# EAGLE schematic Motherboard (EAGLE 6.2)

## Sheet 1 of 9: Main Processor
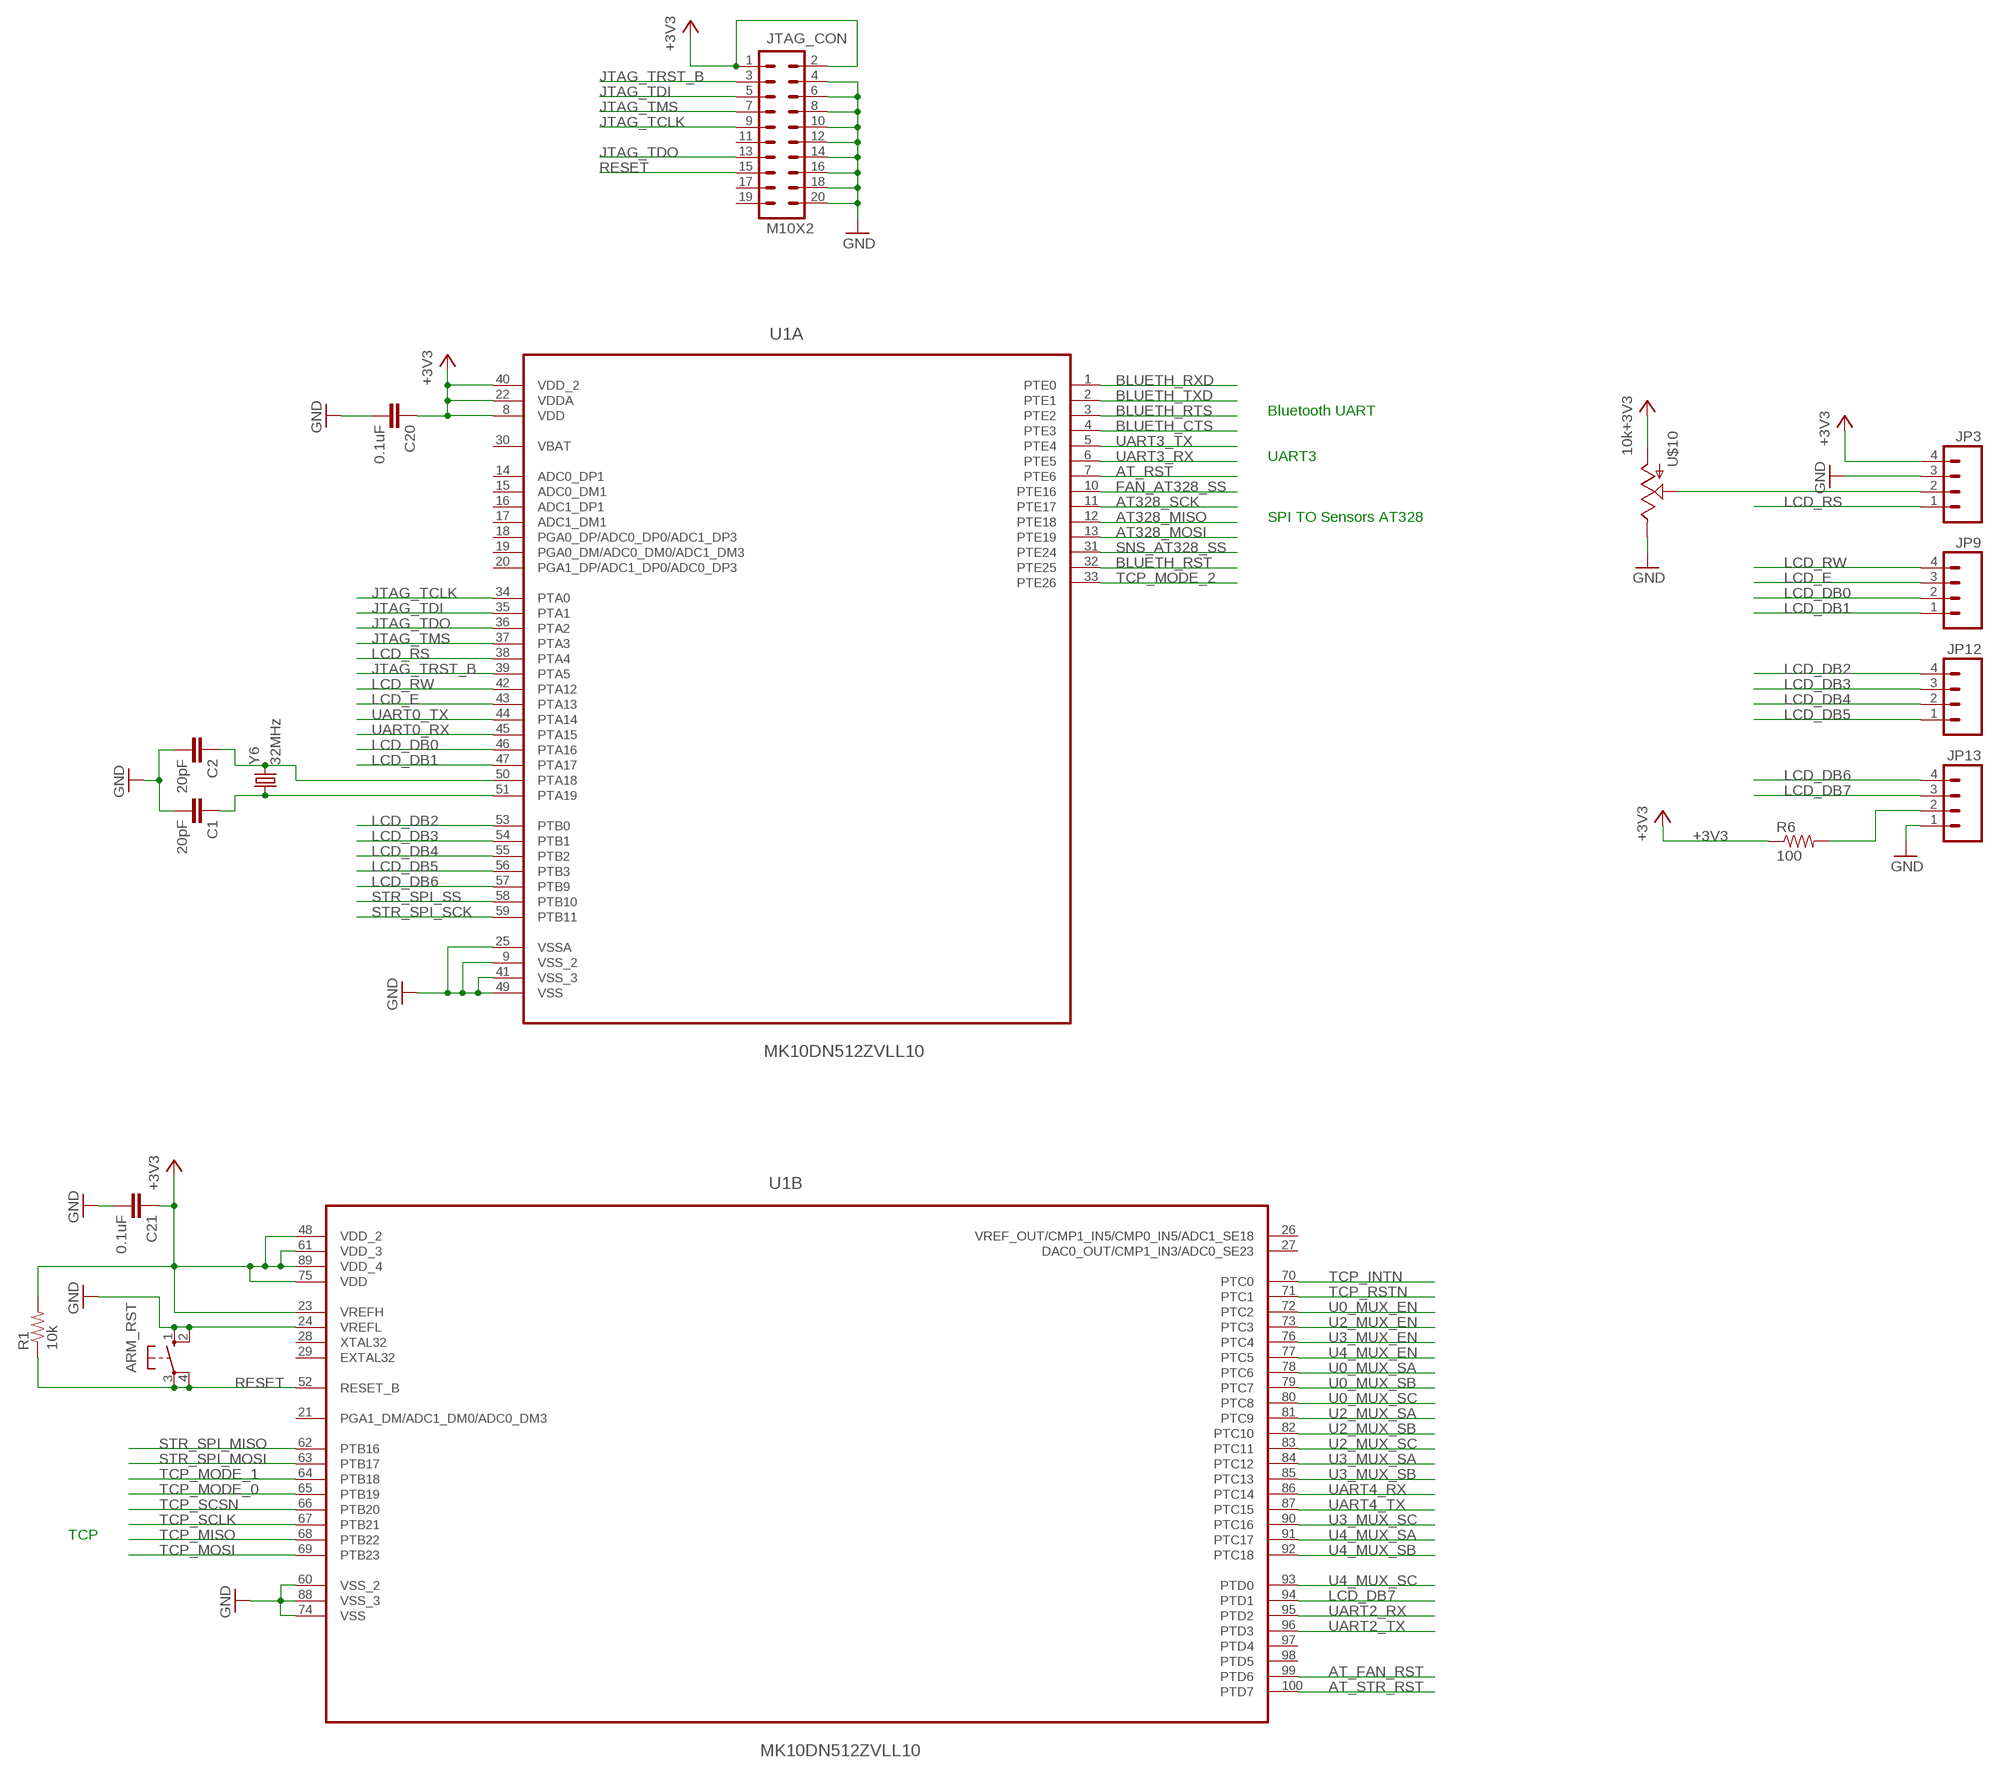
[diagram p0: schematic, sheet 1]

### Parts
ARM_RST  10-XX  [B3F-10XX]
C1  20pF  CAP1206  [1206]
C2  20pF  CAP1206  [1206]
C20  0.1uF  CAP1206  [1206]
C21  0.1uF  CAP1206  [1206]
JP3  M04POLAR  [MOLEX-1X4]
JP9  M04POLAR  [MOLEX-1X4]
JP12  M04POLAR  [MOLEX-1X4]
JP13  M04POLAR  [MOLEX-1X4]
JTAG_CON  M10X2  [2X10]
R1  10k  RESISTOR1206  [1206]
R6  100  RESISTOR1206  [1206]
U1  MK10DN512ZVLL10  [QFP50P1600X1600X170-100N]
U$10  10k  POT100K_3362U  [3362U]
Y6  32MHz  CRYSTAL5X3  [CRYSTAL-SMD-5X3]

### Nets
+3V3: C20.1 C21.1 JP3.4 JTAG_CON.1 JTAG_CON.2 R1.2 R6.1 U1.8(A:VDD) U1.22(A:VDDA) U1.23(B:VREFH) U1.40(A:VDD_2) U1.48(B:VDD_2) U1.61(B:VDD_3) U1.75(B:VDD) U1.89(B:VDD_4) U$10.P$3(A) ; also sheet 2,3,4,5,6,7,8,9
AT328_MISO: U1.12(A:PTE18) ; also sheet 6,8
AT328_MOSI: U1.13(A:PTE19) ; also sheet 6,8
AT328_SCK: U1.11(A:PTE17) ; also sheet 6,8
AT_FAN_RST: U1.99(B:PTD6) ; also sheet 8
AT_RST: U1.7(A:PTE6) ; also sheet 6
AT_STR_RST: U1.100(B:PTD7) ; also sheet 7
BLUETH_CTS: U1.4(A:PTE3) ; also sheet 2
BLUETH_RST: U1.32(A:PTE25) ; also sheet 2
BLUETH_RTS: U1.3(A:PTE2) ; also sheet 2
BLUETH_RXD: U1.1(A:PTE0) ; also sheet 2
BLUETH_TXD: U1.2(A:PTE1) ; also sheet 2
CLKI: C2.1 U1.50(A:PTA18) Y6.3
CLKO: C1.1 U1.51(A:PTA19) Y6.1
FAN_AT328_SS: U1.10(A:PTE16) ; also sheet 8
GND: ARM_RST.1(S) ARM_RST.2(S1) C1.2 C2.2 C20.2 C21.2 JP3.3 JP13.1 JTAG_CON.4 JTAG_CON.6 JTAG_CON.8 JTAG_CON.10 JTAG_CON.12 JTAG_CON.14 JTAG_CON.16 JTAG_CON.18 JTAG_CON.20 U1.9(A:VSS_2) U1.24(B:VREFL) U1.25(A:VSSA) U1.41(A:VSS_3) U1.49(A:VSS) U1.60(B:VSS_2) U1.74(B:VSS) U1.88(B:VSS_3) U$10.P$1(E) ; also sheet 2,3,4,5,6,7,8,9
JTAG_TCLK: JTAG_CON.9 U1.34(A:PTA0)
JTAG_TDI: JTAG_CON.5 U1.35(A:PTA1)
JTAG_TDO: JTAG_CON.13 U1.36(A:PTA2)
JTAG_TMS: JTAG_CON.7 U1.37(A:PTA3)
JTAG_TRST_B: JTAG_CON.3 U1.39(A:PTA5)
LCD_DB0: JP9.2 U1.46(A:PTA16)
LCD_DB1: JP9.1 U1.47(A:PTA17)
LCD_DB2: JP12.4 U1.53(A:PTB0)
LCD_DB3: JP12.3 U1.54(A:PTB1)
LCD_DB4: JP12.2 U1.55(A:PTB2)
LCD_DB5: JP12.1 U1.56(A:PTB3)
LCD_DB6: JP13.4 U1.57(A:PTB9)
LCD_DB7: JP13.3 U1.94(B:PTD1)
LCD_E: JP9.3 U1.43(A:PTA13)
LCD_RS: JP3.1 U1.38(A:PTA4)
LCD_RW: JP9.4 U1.42(A:PTA12)
N$46: JP13.2 R6.2
N$60: JP3.2 U$10.P$2(S)
RESET: ARM_RST.3(P) ARM_RST.4(P1) JTAG_CON.15 R1.1 U1.52(B:RESET_B)
SNS_AT328_SS: U1.31(A:PTE24) ; also sheet 6
STR_SPI_MISO: U1.62(B:PTB16) ; also sheet 7
STR_SPI_MOSI: U1.63(B:PTB17) ; also sheet 7
STR_SPI_SCK: U1.59(A:PTB11) ; also sheet 7
STR_SPI_SS: U1.58(A:PTB10) ; also sheet 7
TCP_INTN: U1.70(B:PTC0) ; also sheet 2
TCP_MISO: U1.68(B:PTB22) ; also sheet 2
TCP_MODE_0: U1.65(B:PTB19) ; also sheet 2
TCP_MODE_1: U1.64(B:PTB18) ; also sheet 2
TCP_MODE_2: U1.33(A:PTE26) ; also sheet 2
TCP_MOSI: U1.69(B:PTB23) ; also sheet 2
TCP_RSTN: U1.71(B:PTC1) ; also sheet 2
TCP_SCLK: U1.67(B:PTB21) ; also sheet 2
TCP_SCSN: U1.66(B:PTB20) ; also sheet 2
U0_MUX_EN: U1.72(B:PTC2) ; also sheet 3
U0_MUX_SA: U1.78(B:PTC6) ; also sheet 3
U0_MUX_SB: U1.79(B:PTC7) ; also sheet 3
U0_MUX_SC: U1.80(B:PTC8) ; also sheet 3
U2_MUX_EN: U1.73(B:PTC3) ; also sheet 3
U2_MUX_SA: U1.81(B:PTC9) ; also sheet 3
U2_MUX_SB: U1.82(B:PTC10) ; also sheet 3
U2_MUX_SC: U1.83(B:PTC11) ; also sheet 3
U3_MUX_EN: U1.76(B:PTC4) ; also sheet 3
U3_MUX_SA: U1.84(B:PTC12) ; also sheet 3
U3_MUX_SB: U1.85(B:PTC13) ; also sheet 3
U3_MUX_SC: U1.90(B:PTC16) ; also sheet 3
U4_MUX_EN: U1.77(B:PTC5) ; also sheet 3
U4_MUX_SA: U1.91(B:PTC17) ; also sheet 3
U4_MUX_SB: U1.92(B:PTC18) ; also sheet 3
U4_MUX_SC: U1.93(B:PTD0) ; also sheet 3
UART0_RX: U1.45(A:PTA15) ; also sheet 3
UART0_TX: U1.44(A:PTA14) ; also sheet 3
UART2_RX: U1.95(B:PTD2) ; also sheet 3
UART2_TX: U1.96(B:PTD3) ; also sheet 3
UART3_RX: U1.6(A:PTE5) ; also sheet 3
UART3_TX: U1.5(A:PTE4) ; also sheet 3
UART4_RX: U1.86(B:PTC14) ; also sheet 3
UART4_TX: U1.87(B:PTC15) ; also sheet 3
Unconnected: JTAG_CON.11 JTAG_CON.17 JTAG_CON.19 U1.14(A:ADC0_DP1) U1.15(A:ADC0_DM1) U1.16(A:ADC1_DP1) U1.17(A:ADC1_DM1) U1.18(A:PGA0_DP/ADC0_DP0/ADC1_DP3) U1.19(A:PGA0_DM/ADC0_DM0/ADC1_DM3) U1.20(A:PGA1_DP/ADC1_DP0/ADC0_DP3) U1.21(B:PGA1_DM/ADC1_DM0/ADC0_DM3) U1.26(B:VREF_OUT/CMP1_IN5/CMP0_IN5/ADC1_SE18) U1.27(B:DAC0_OUT/CMP1_IN3/ADC0_SE23) U1.28(B:XTAL32) U1.29(B:EXTAL32) U1.97(B:PTD4) U1.98(B:PTD5)

### Notes on the sheet
- Bluetooth UART
- UART3
- SPI TO Sensors AT328
- TCP

## Sheet 2 of 9: I/O
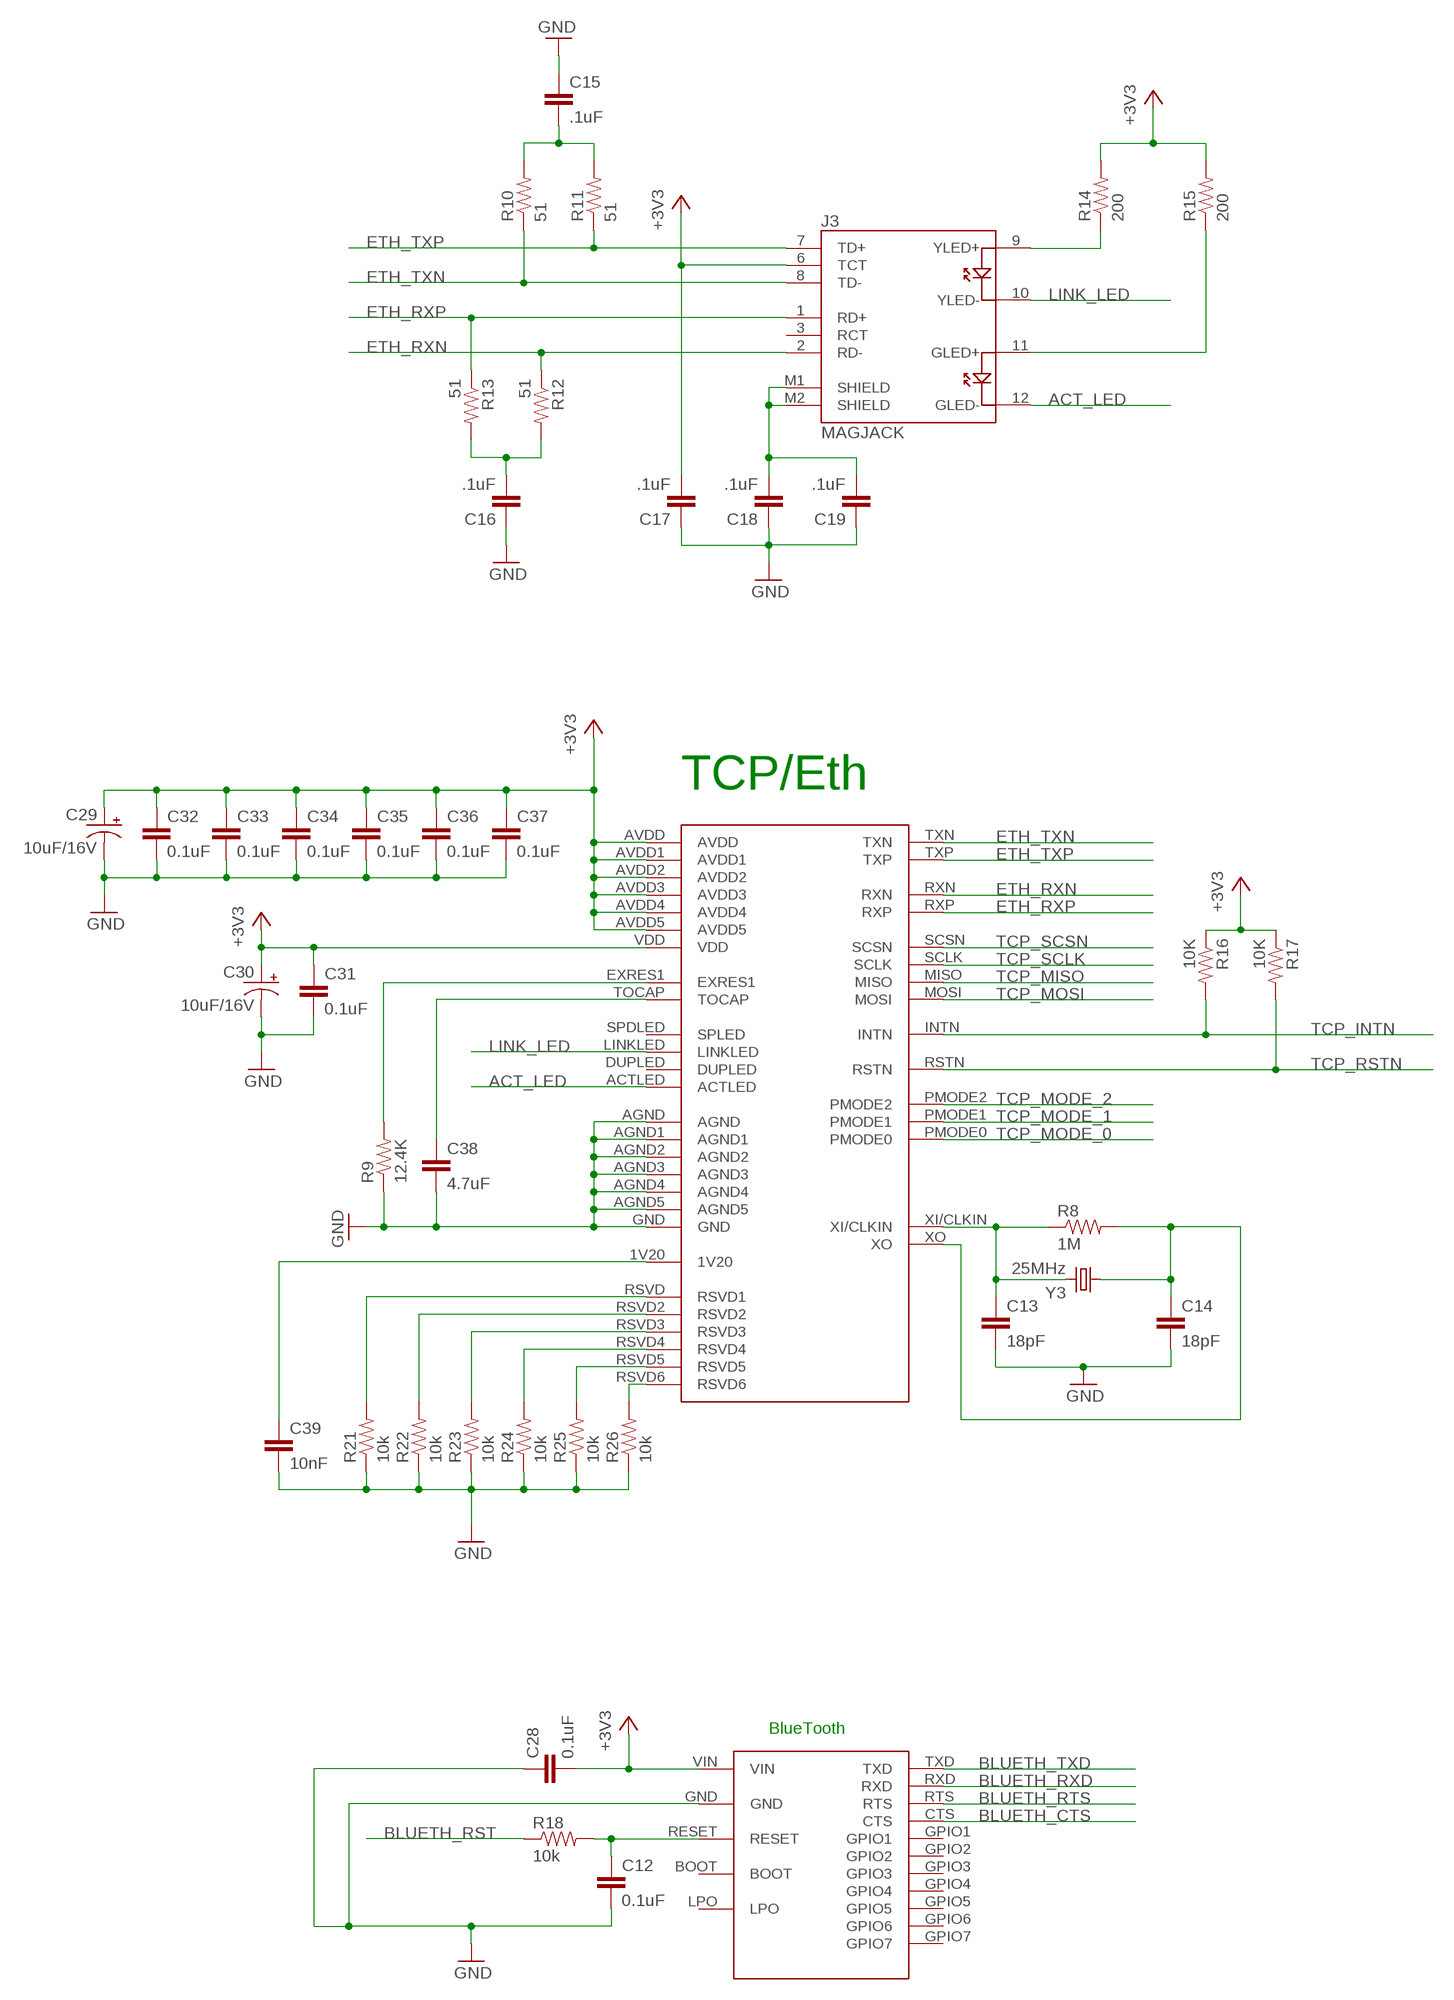
[diagram p1: schematic, sheet 2]

### Parts
BLUETOOTH  SPBT2632C2A  [SPBT2632C2A]
C12  0.1uF  CAP1206  [1206]
C13  18pF  CAP1206  [1206]
C14  18pF  CAP1206  [1206]
C15  .1uF  CAP1206  [1206]
C16  .1uF  CAP1206  [1206]
C17  .1uF  CAP1206  [1206]
C18  .1uF  CAP1206  [1206]
C19  .1uF  CAP1206  [1206]
C28  0.1uF  CAP1206  [1206]
C29  10uF/16V  CAP_POL1206  [EIA3216]
C30  10uF/16V  CAP_POL1206  [EIA3216]
C31  0.1uF  CAP1206  [1206]
C32  0.1uF  CAP1206  [1206]
C33  0.1uF  CAP1206  [1206]
C34  0.1uF  CAP1206  [1206]
C35  0.1uF  CAP1206  [1206]
C36  0.1uF  CAP1206  [1206]
C37  0.1uF  CAP1206  [1206]
C38  4.7uF  CAP1206  [1206]
C39  10nF  CAP1206  [1206]
J3  MAGJACK  [MAGJACK]
R8  1M  RESISTOR1206  [1206]
R9  12.4K  RESISTOR1206  [1206]
R10  51  RESISTOR1206  [1206]
R11  51  RESISTOR1206  [1206]
R12  51  RESISTOR1206  [1206]
R13  51  RESISTOR1206  [1206]
R14  200  RESISTOR1206  [1206]
R15  200  RESISTOR1206  [1206]
R16  10K  RESISTOR1206  [1206]
R17  10K  RESISTOR1206  [1206]
R18  10k  RESISTOR1206  [1206]
R21  10k  RESISTOR1206  [1206]
R22  10k  RESISTOR1206  [1206]
R23  10k  RESISTOR1206  [1206]
R24  10k  RESISTOR1206  [1206]
R25  10k  RESISTOR1206  [1206]
R26  10k  RESISTOR1206  [1206]
U$11  W5500  [W5500]
Y3  25MHz  CRYSTALHC49US  [HC49US]

### Nets
+3V3: BLUETOOTH.VIN C17.2 C28.2 C29.A(+) C30.A(+) C31.1 C32.1 C33.1 C34.1 C35.1 C36.1 C37.1 J3.6(TCT) R14.2 R15.2 R16.1 R17.1 U$11.AVDD U$11.AVDD1 U$11.AVDD2 U$11.AVDD3 U$11.AVDD4 U$11.AVDD5 U$11.VDD ; also sheet 1,3,4,5,6,7,8,9
ACT_LED: J3.12(GLED-) U$11.ACTLED
BLUETH_CTS: BLUETOOTH.CTS ; also sheet 1
BLUETH_RST: R18.1 ; also sheet 1
BLUETH_RTS: BLUETOOTH.RTS ; also sheet 1
BLUETH_RXD: BLUETOOTH.RXD ; also sheet 1
BLUETH_TXD: BLUETOOTH.TXD ; also sheet 1
ETH_RXN: J3.2(RD-) R12.1 U$11.RXN
ETH_RXP: J3.1(RD+) R13.1 U$11.RXP
ETH_TXN: J3.8(TD-) R10.1 U$11.TXN
ETH_TXP: J3.7(TD+) R11.1 U$11.TXP
GND: BLUETOOTH.GND C12.2 C13.2 C14.2 C15.1 C16.1 C17.1 C18.1 C19.1 C28.1 C29.C(-) C30.C(-) C31.2 C32.2 C33.2 C34.2 C35.2 C36.2 C37.2 C38.2 C39.2 R9.1 R21.1 R22.1 R23.1 R24.1 R25.1 R26.1 U$11.AGND U$11.AGND1 U$11.AGND2 U$11.AGND3 U$11.AGND4 U$11.AGND5 U$11.GND ; also sheet 1,3,4,5,6,7,8,9
LINK_LED: J3.10(YLED-) U$11.LINKLED
N$23: C13.1 R8.1 U$11.XI/CLKIN Y3.2
N$24: R9.2 U$11.EXRES1
N$25: C14.1 R8.2 U$11.XO Y3.1
N$26: C15.2 R10.2 R11.2
N$27: C16.2 R12.2 R13.2
N$30: J3.9(YLED+) R14.1
N$31: C18.2 C19.2 J3.M1(SHIELD) J3.M2(SHIELD)
N$32: J3.11(GLED+) R15.1
N$50: C38.1 U$11.TOCAP
N$51: R26.2 U$11.RSVD6
N$52: R25.2 U$11.RSVD5
N$53: R24.2 U$11.RSVD4
N$54: R23.2 U$11.RSVD3
N$55: R22.2 U$11.RSVD2
N$56: R21.2 U$11.RSVD(RSVD1)
N$57: C39.1 U$11.1V20
N$58: BLUETOOTH.RESET C12.1 R18.2
TCP_INTN: R16.2 U$11.INTN ; also sheet 1
TCP_MISO: U$11.MISO ; also sheet 1
TCP_MODE_0: U$11.PMODE0 ; also sheet 1
TCP_MODE_1: U$11.PMODE1 ; also sheet 1
TCP_MODE_2: U$11.PMODE2 ; also sheet 1
TCP_MOSI: U$11.MOSI ; also sheet 1
TCP_RSTN: R17.2 U$11.RSTN ; also sheet 1
TCP_SCLK: U$11.SCLK ; also sheet 1
TCP_SCSN: U$11.SCSN ; also sheet 1
Unconnected: BLUETOOTH.BOOT BLUETOOTH.GPIO1 BLUETOOTH.GPIO2 BLUETOOTH.GPIO3 BLUETOOTH.GPIO4 BLUETOOTH.GPIO5 BLUETOOTH.GPIO6 BLUETOOTH.GPIO7 BLUETOOTH.LPO J3.3(RCT) U$11.DUPLED U$11.SPDLED(SPLED)

### Notes on the sheet
- TCP/Eth
- BlueTooth

## Sheet 3 of 9: Muxes
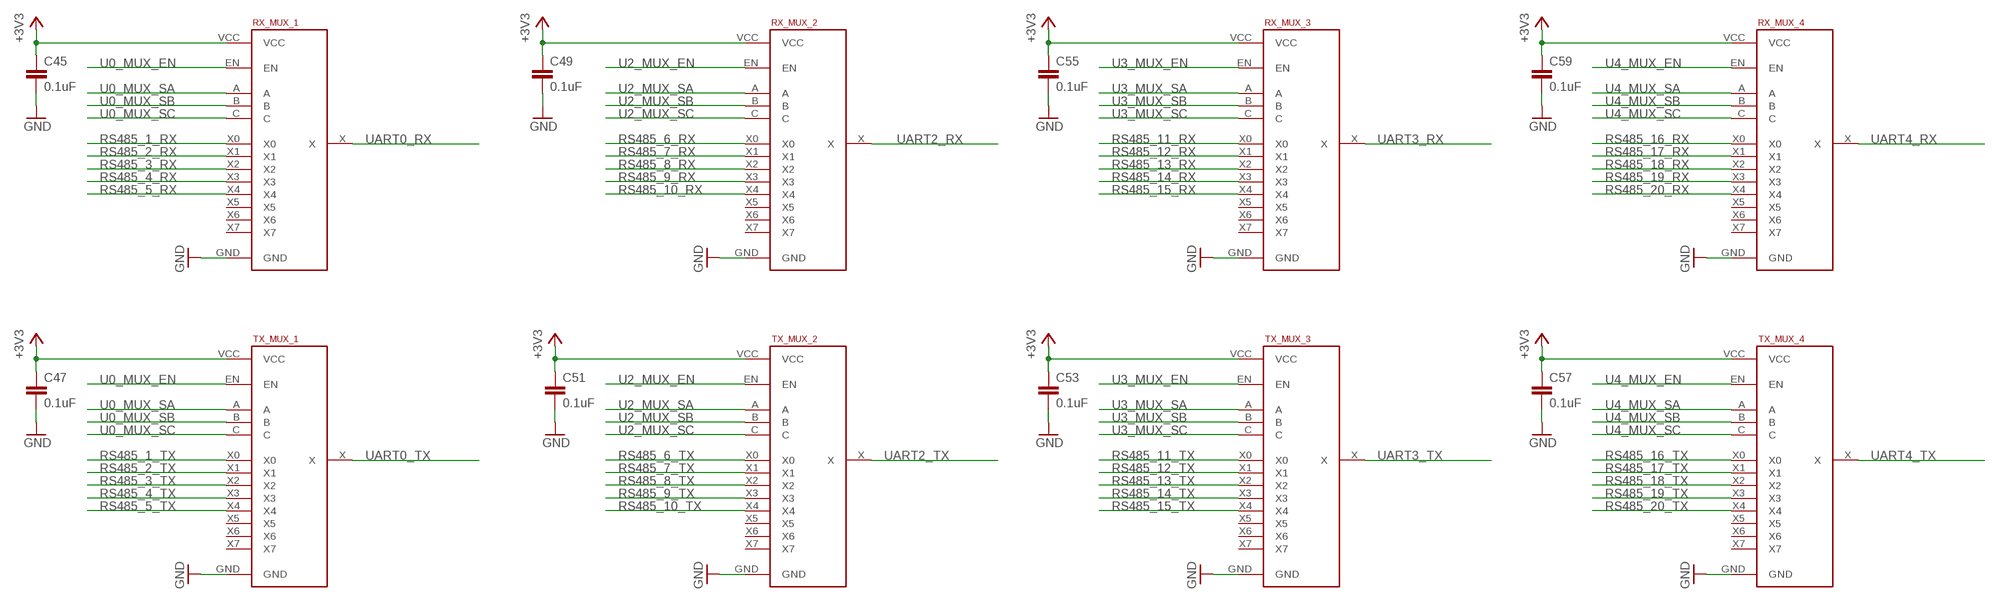
[diagram p2: schematic, sheet 3]

### Parts
C45  0.1uF  CAP1206  [1206]
C47  0.1uF  CAP1206  [1206]
C49  0.1uF  CAP1206  [1206]
C51  0.1uF  CAP1206  [1206]
C53  0.1uF  CAP1206  [1206]
C55  0.1uF  CAP1206  [1206]
C57  0.1uF  CAP1206  [1206]
C59  0.1uF  CAP1206  [1206]
RX_MUX_1  8:1 Mux  MC74LVXT8051DG  [SOIC16N]
RX_MUX_2  8:1 Mux  MC74LVXT8051DG  [SOIC16N]
RX_MUX_3  8:1 Mux  MC74LVXT8051DG  [SOIC16N]
RX_MUX_4  8:1 Mux  MC74LVXT8051DG  [SOIC16N]
TX_MUX_1  8:1 Mux  MC74LVXT8051DG  [SOIC16N]
TX_MUX_2  8:1 Mux  MC74LVXT8051DG  [SOIC16N]
TX_MUX_3  8:1 Mux  MC74LVXT8051DG  [SOIC16N]
TX_MUX_4  8:1 Mux  MC74LVXT8051DG  [SOIC16N]

### Nets
+3V3: C45.1 C47.1 C49.1 C51.1 C53.1 C55.1 C57.1 C59.1 RX_MUX_1.VCC RX_MUX_2.VCC RX_MUX_3.VCC RX_MUX_4.VCC TX_MUX_1.VCC TX_MUX_2.VCC TX_MUX_3.VCC TX_MUX_4.VCC ; also sheet 1,2,4,5,6,7,8,9
GND: C45.2 C47.2 C49.2 C51.2 C53.2 C55.2 C57.2 C59.2 RX_MUX_1.GND RX_MUX_2.GND RX_MUX_3.GND RX_MUX_4.GND TX_MUX_1.GND TX_MUX_2.GND TX_MUX_3.GND TX_MUX_4.GND ; also sheet 1,2,4,5,6,7,8,9
RS485_1_RX: RX_MUX_1.X0 ; also sheet 4
RS485_1_TX: TX_MUX_1.X0 ; also sheet 4
RS485_2_RX: RX_MUX_1.X1 ; also sheet 4
RS485_2_TX: TX_MUX_1.X1 ; also sheet 4
RS485_3_RX: RX_MUX_1.X2 ; also sheet 4
RS485_3_TX: TX_MUX_1.X2 ; also sheet 4
RS485_4_RX: RX_MUX_1.X3 ; also sheet 4
RS485_4_TX: TX_MUX_1.X3 ; also sheet 4
RS485_5_RX: RX_MUX_1.X4 ; also sheet 4
RS485_5_TX: TX_MUX_1.X4 ; also sheet 4
RS485_6_RX: RX_MUX_2.X0 ; also sheet 4
RS485_6_TX: TX_MUX_2.X0 ; also sheet 4
RS485_7_RX: RX_MUX_2.X1 ; also sheet 4
RS485_7_TX: TX_MUX_2.X1 ; also sheet 4
RS485_8_RX: RX_MUX_2.X2 ; also sheet 4
RS485_8_TX: TX_MUX_2.X2 ; also sheet 4
RS485_9_RX: RX_MUX_2.X3 ; also sheet 4
RS485_9_TX: TX_MUX_2.X3 ; also sheet 4
RS485_10_RX: RX_MUX_2.X4 ; also sheet 4
RS485_10_TX: TX_MUX_2.X4 ; also sheet 4
RS485_11_RX: RX_MUX_3.X0 ; also sheet 4
RS485_11_TX: TX_MUX_3.X0 ; also sheet 4
RS485_12_RX: RX_MUX_3.X1 ; also sheet 4
RS485_12_TX: TX_MUX_3.X1 ; also sheet 4
RS485_13_RX: RX_MUX_3.X2 ; also sheet 5
RS485_13_TX: TX_MUX_3.X2 ; also sheet 5
RS485_14_RX: RX_MUX_3.X3 ; also sheet 5
RS485_14_TX: TX_MUX_3.X3 ; also sheet 5
RS485_15_RX: RX_MUX_3.X4 ; also sheet 5
RS485_15_TX: TX_MUX_3.X4 ; also sheet 5
RS485_16_RX: RX_MUX_4.X0 ; also sheet 5
RS485_16_TX: TX_MUX_4.X0 ; also sheet 5
RS485_17_RX: RX_MUX_4.X1 ; also sheet 5
RS485_17_TX: TX_MUX_4.X1 ; also sheet 5
RS485_18_RX: RX_MUX_4.X2 ; also sheet 5
RS485_18_TX: TX_MUX_4.X2 ; also sheet 5
RS485_19_RX: RX_MUX_4.X3 ; also sheet 5
RS485_19_TX: TX_MUX_4.X3 ; also sheet 5
RS485_20_RX: RX_MUX_4.X4 ; also sheet 5
RS485_20_TX: TX_MUX_4.X4 ; also sheet 5
U0_MUX_EN: RX_MUX_1.EN TX_MUX_1.EN ; also sheet 1
U0_MUX_SA: RX_MUX_1.A TX_MUX_1.A ; also sheet 1
U0_MUX_SB: RX_MUX_1.B TX_MUX_1.B ; also sheet 1
U0_MUX_SC: RX_MUX_1.C TX_MUX_1.C ; also sheet 1
U2_MUX_EN: RX_MUX_2.EN TX_MUX_2.EN ; also sheet 1
U2_MUX_SA: RX_MUX_2.A TX_MUX_2.A ; also sheet 1
U2_MUX_SB: RX_MUX_2.B TX_MUX_2.B ; also sheet 1
U2_MUX_SC: RX_MUX_2.C TX_MUX_2.C ; also sheet 1
U3_MUX_EN: RX_MUX_3.EN TX_MUX_3.EN ; also sheet 1
U3_MUX_SA: RX_MUX_3.A TX_MUX_3.A ; also sheet 1
U3_MUX_SB: RX_MUX_3.B TX_MUX_3.B ; also sheet 1
U3_MUX_SC: RX_MUX_3.C TX_MUX_3.C ; also sheet 1
U4_MUX_EN: RX_MUX_4.EN TX_MUX_4.EN ; also sheet 1
U4_MUX_SA: RX_MUX_4.A TX_MUX_4.A ; also sheet 1
U4_MUX_SB: RX_MUX_4.B TX_MUX_4.B ; also sheet 1
U4_MUX_SC: RX_MUX_4.C TX_MUX_4.C ; also sheet 1
UART0_RX: RX_MUX_1.X ; also sheet 1
UART0_TX: TX_MUX_1.X ; also sheet 1
UART2_RX: RX_MUX_2.X ; also sheet 1
UART2_TX: TX_MUX_2.X ; also sheet 1
UART3_RX: RX_MUX_3.X ; also sheet 1
UART3_TX: TX_MUX_3.X ; also sheet 1
UART4_RX: RX_MUX_4.X ; also sheet 1
UART4_TX: TX_MUX_4.X ; also sheet 1
Unconnected: RX_MUX_1.X5 RX_MUX_1.X6 RX_MUX_1.X7 RX_MUX_2.X5 RX_MUX_2.X6 RX_MUX_2.X7 RX_MUX_3.X5 RX_MUX_3.X6 RX_MUX_3.X7 RX_MUX_4.X5 RX_MUX_4.X6 RX_MUX_4.X7 TX_MUX_1.X5 TX_MUX_1.X6 TX_MUX_1.X7 TX_MUX_2.X5 TX_MUX_2.X6 TX_MUX_2.X7 TX_MUX_3.X5 TX_MUX_3.X6 TX_MUX_3.X7 TX_MUX_4.X5 TX_MUX_4.X6 TX_MUX_4.X7

## Sheet 4 of 9: RS-485 External
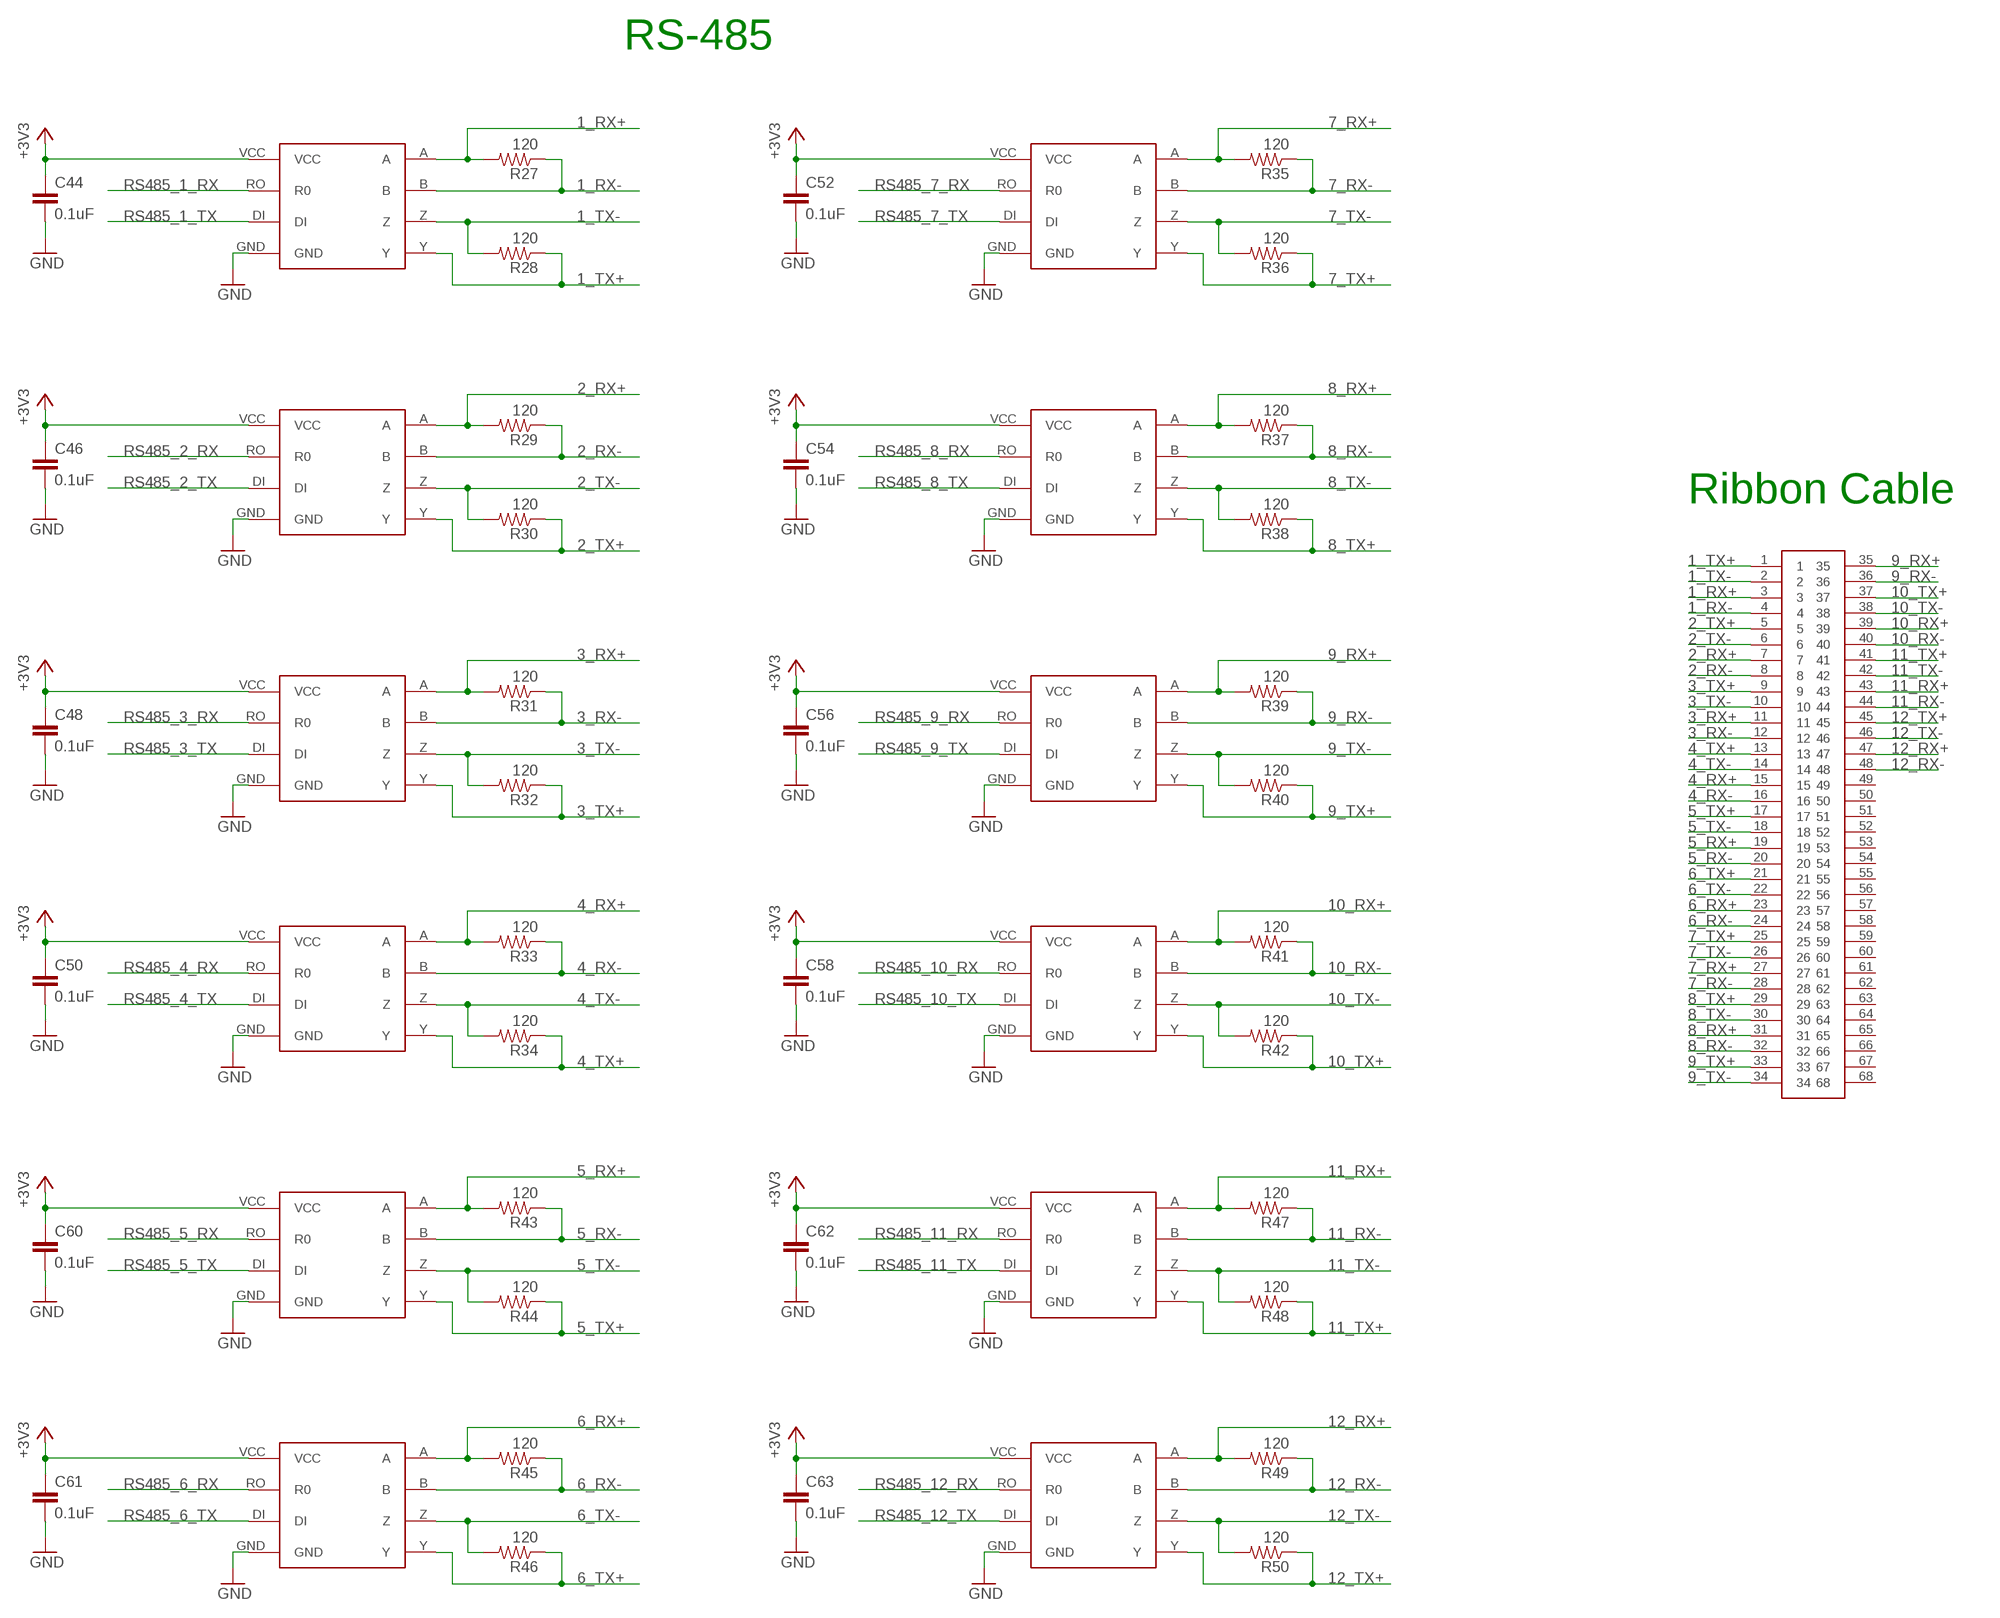
[diagram p3: schematic, sheet 4]

### Parts
C44  0.1uF  CAP1206  [1206]
C46  0.1uF  CAP1206  [1206]
C48  0.1uF  CAP1206  [1206]
C50  0.1uF  CAP1206  [1206]
C52  0.1uF  CAP1206  [1206]
C54  0.1uF  CAP1206  [1206]
C56  0.1uF  CAP1206  [1206]
C58  0.1uF  CAP1206  [1206]
C60  0.1uF  CAP1206  [1206]
C61  0.1uF  CAP1206  [1206]
C62  0.1uF  CAP1206  [1206]
C63  0.1uF  CAP1206  [1206]
R27  120  RESISTOR1206  [1206]
R28  120  RESISTOR1206  [1206]
R29  120  RESISTOR1206  [1206]
R30  120  RESISTOR1206  [1206]
R31  120  RESISTOR1206  [1206]
R32  120  RESISTOR1206  [1206]
R33  120  RESISTOR1206  [1206]
R34  120  RESISTOR1206  [1206]
R35  120  RESISTOR1206  [1206]
R36  120  RESISTOR1206  [1206]
R37  120  RESISTOR1206  [1206]
R38  120  RESISTOR1206  [1206]
R39  120  RESISTOR1206  [1206]
R40  120  RESISTOR1206  [1206]
R41  120  RESISTOR1206  [1206]
R42  120  RESISTOR1206  [1206]
R43  120  RESISTOR1206  [1206]
R44  120  RESISTOR1206  [1206]
R45  120  RESISTOR1206  [1206]
R46  120  RESISTOR1206  [1206]
R47  120  RESISTOR1206  [1206]
R48  120  RESISTOR1206  [1206]
R49  120  RESISTOR1206  [1206]
R50  120  RESISTOR1206  [1206]
RS_TRANS_1  MAX3077  [MAX3070E]
RS_TRANS_2  MAX3077  [MAX3070E]
RS_TRANS_3  MAX3077  [MAX3070E]
RS_TRANS_4  MAX3077  [MAX3070E]
RS_TRANS_5  MAX3077  [MAX3070E]
RS_TRANS_6  MAX3077  [MAX3070E]
RS_TRANS_7  MAX3077  [MAX3070E]
RS_TRANS_8  MAX3077  [MAX3070E]
RS_TRANS_9  MAX3077  [MAX3070E]
RS_TRANS_10  MAX3077  [MAX3070E]
RS_TRANS_11  MAX3077  [MAX3070E]
RS_TRANS_12  MAX3077  [MAX3070E]
U$36  TB60050685100  [60050685100]

### Nets
1_RX+: R27.2 RS_TRANS_1.A U$36.3
1_RX-: R27.1 RS_TRANS_1.B U$36.4
1_TX+: R28.1 RS_TRANS_1.Y U$36.1
1_TX-: R28.2 RS_TRANS_1.Z U$36.2
2_RX+: R29.2 RS_TRANS_2.A U$36.7
2_RX-: R29.1 RS_TRANS_2.B U$36.8
2_TX+: R30.1 RS_TRANS_2.Y U$36.5
2_TX-: R30.2 RS_TRANS_2.Z U$36.6
3_RX+: R31.2 RS_TRANS_3.A U$36.11
3_RX-: R31.1 RS_TRANS_3.B U$36.12
3_TX+: R32.1 RS_TRANS_3.Y U$36.9
3_TX-: R32.2 RS_TRANS_3.Z U$36.10
4_RX+: R33.2 RS_TRANS_4.A U$36.15
4_RX-: R33.1 RS_TRANS_4.B U$36.16
4_TX+: R34.1 RS_TRANS_4.Y U$36.13
4_TX-: R34.2 RS_TRANS_4.Z U$36.14
5_RX+: R43.2 RS_TRANS_9.A U$36.19
5_RX-: R43.1 RS_TRANS_9.B U$36.20
5_TX+: R44.1 RS_TRANS_9.Y U$36.17
5_TX-: R44.2 RS_TRANS_9.Z U$36.18
6_RX+: R45.2 RS_TRANS_10.A U$36.23
6_RX-: R45.1 RS_TRANS_10.B U$36.24
6_TX+: R46.1 RS_TRANS_10.Y U$36.21
6_TX-: R46.2 RS_TRANS_10.Z U$36.22
7_RX+: R35.2 RS_TRANS_5.A U$36.27
7_RX-: R35.1 RS_TRANS_5.B U$36.28
7_TX+: R36.1 RS_TRANS_5.Y U$36.25
7_TX-: R36.2 RS_TRANS_5.Z U$36.26
8_RX+: R37.2 RS_TRANS_6.A U$36.31
8_RX-: R37.1 RS_TRANS_6.B U$36.32
8_TX+: R38.1 RS_TRANS_6.Y U$36.29
8_TX-: R38.2 RS_TRANS_6.Z U$36.30
9_RX+: R39.2 RS_TRANS_7.A U$36.35
9_RX-: R39.1 RS_TRANS_7.B U$36.36
9_TX+: R40.1 RS_TRANS_7.Y U$36.33
9_TX-: R40.2 RS_TRANS_7.Z U$36.34
10_RX+: R41.2 RS_TRANS_8.A U$36.39
10_RX-: R41.1 RS_TRANS_8.B U$36.40
10_TX+: R42.1 RS_TRANS_8.Y U$36.37
10_TX-: R42.2 RS_TRANS_8.Z U$36.38
11_RX+: R47.2 RS_TRANS_11.A U$36.43
11_RX-: R47.1 RS_TRANS_11.B U$36.44
11_TX+: R48.1 RS_TRANS_11.Y U$36.41
11_TX-: R48.2 RS_TRANS_11.Z U$36.42
12_RX+: R49.2 RS_TRANS_12.A U$36.47
12_RX-: R49.1 RS_TRANS_12.B U$36.48
12_TX+: R50.1 RS_TRANS_12.Y U$36.45
12_TX-: R50.2 RS_TRANS_12.Z U$36.46
+3V3: C44.1 C46.1 C48.1 C50.1 C52.1 C54.1 C56.1 C58.1 C60.1 C61.1 C62.1 C63.1 RS_TRANS_1.VCC RS_TRANS_2.VCC RS_TRANS_3.VCC RS_TRANS_4.VCC RS_TRANS_5.VCC RS_TRANS_6.VCC RS_TRANS_7.VCC RS_TRANS_8.VCC RS_TRANS_9.VCC RS_TRANS_10.VCC RS_TRANS_11.VCC RS_TRANS_12.VCC ; also sheet 1,2,3,5,6,7,8,9
GND: C44.2 C46.2 C48.2 C50.2 C52.2 C54.2 C56.2 C58.2 C60.2 C61.2 C62.2 C63.2 RS_TRANS_1.GND RS_TRANS_2.GND RS_TRANS_3.GND RS_TRANS_4.GND RS_TRANS_5.GND RS_TRANS_6.GND RS_TRANS_7.GND RS_TRANS_8.GND RS_TRANS_9.GND RS_TRANS_10.GND RS_TRANS_11.GND RS_TRANS_12.GND ; also sheet 1,2,3,5,6,7,8,9
RS485_1_RX: RS_TRANS_1.RO(R0) ; also sheet 3
RS485_1_TX: RS_TRANS_1.DI ; also sheet 3
RS485_2_RX: RS_TRANS_2.RO(R0) ; also sheet 3
RS485_2_TX: RS_TRANS_2.DI ; also sheet 3
RS485_3_RX: RS_TRANS_3.RO(R0) ; also sheet 3
RS485_3_TX: RS_TRANS_3.DI ; also sheet 3
RS485_4_RX: RS_TRANS_4.RO(R0) ; also sheet 3
RS485_4_TX: RS_TRANS_4.DI ; also sheet 3
RS485_5_RX: RS_TRANS_9.RO(R0) ; also sheet 3
RS485_5_TX: RS_TRANS_9.DI ; also sheet 3
RS485_6_RX: RS_TRANS_10.RO(R0) ; also sheet 3
RS485_6_TX: RS_TRANS_10.DI ; also sheet 3
RS485_7_RX: RS_TRANS_5.RO(R0) ; also sheet 3
RS485_7_TX: RS_TRANS_5.DI ; also sheet 3
RS485_8_RX: RS_TRANS_6.RO(R0) ; also sheet 3
RS485_8_TX: RS_TRANS_6.DI ; also sheet 3
RS485_9_RX: RS_TRANS_7.RO(R0) ; also sheet 3
RS485_9_TX: RS_TRANS_7.DI ; also sheet 3
RS485_10_RX: RS_TRANS_8.RO(R0) ; also sheet 3
RS485_10_TX: RS_TRANS_8.DI ; also sheet 3
RS485_11_RX: RS_TRANS_11.RO(R0) ; also sheet 3
RS485_11_TX: RS_TRANS_11.DI ; also sheet 3
RS485_12_RX: RS_TRANS_12.RO(R0) ; also sheet 3
RS485_12_TX: RS_TRANS_12.DI ; also sheet 3
Unconnected: U$36.49 U$36.50 U$36.51 U$36.52 U$36.53 U$36.54 U$36.55 U$36.56 U$36.57 U$36.58 U$36.59 U$36.60 U$36.61 U$36.62 U$36.63 U$36.64 U$36.65 U$36.66 U$36.67 U$36.68

### Notes on the sheet
- RS-485
- Ribbon Cable

## Sheet 5 of 9: RS-485 Internal
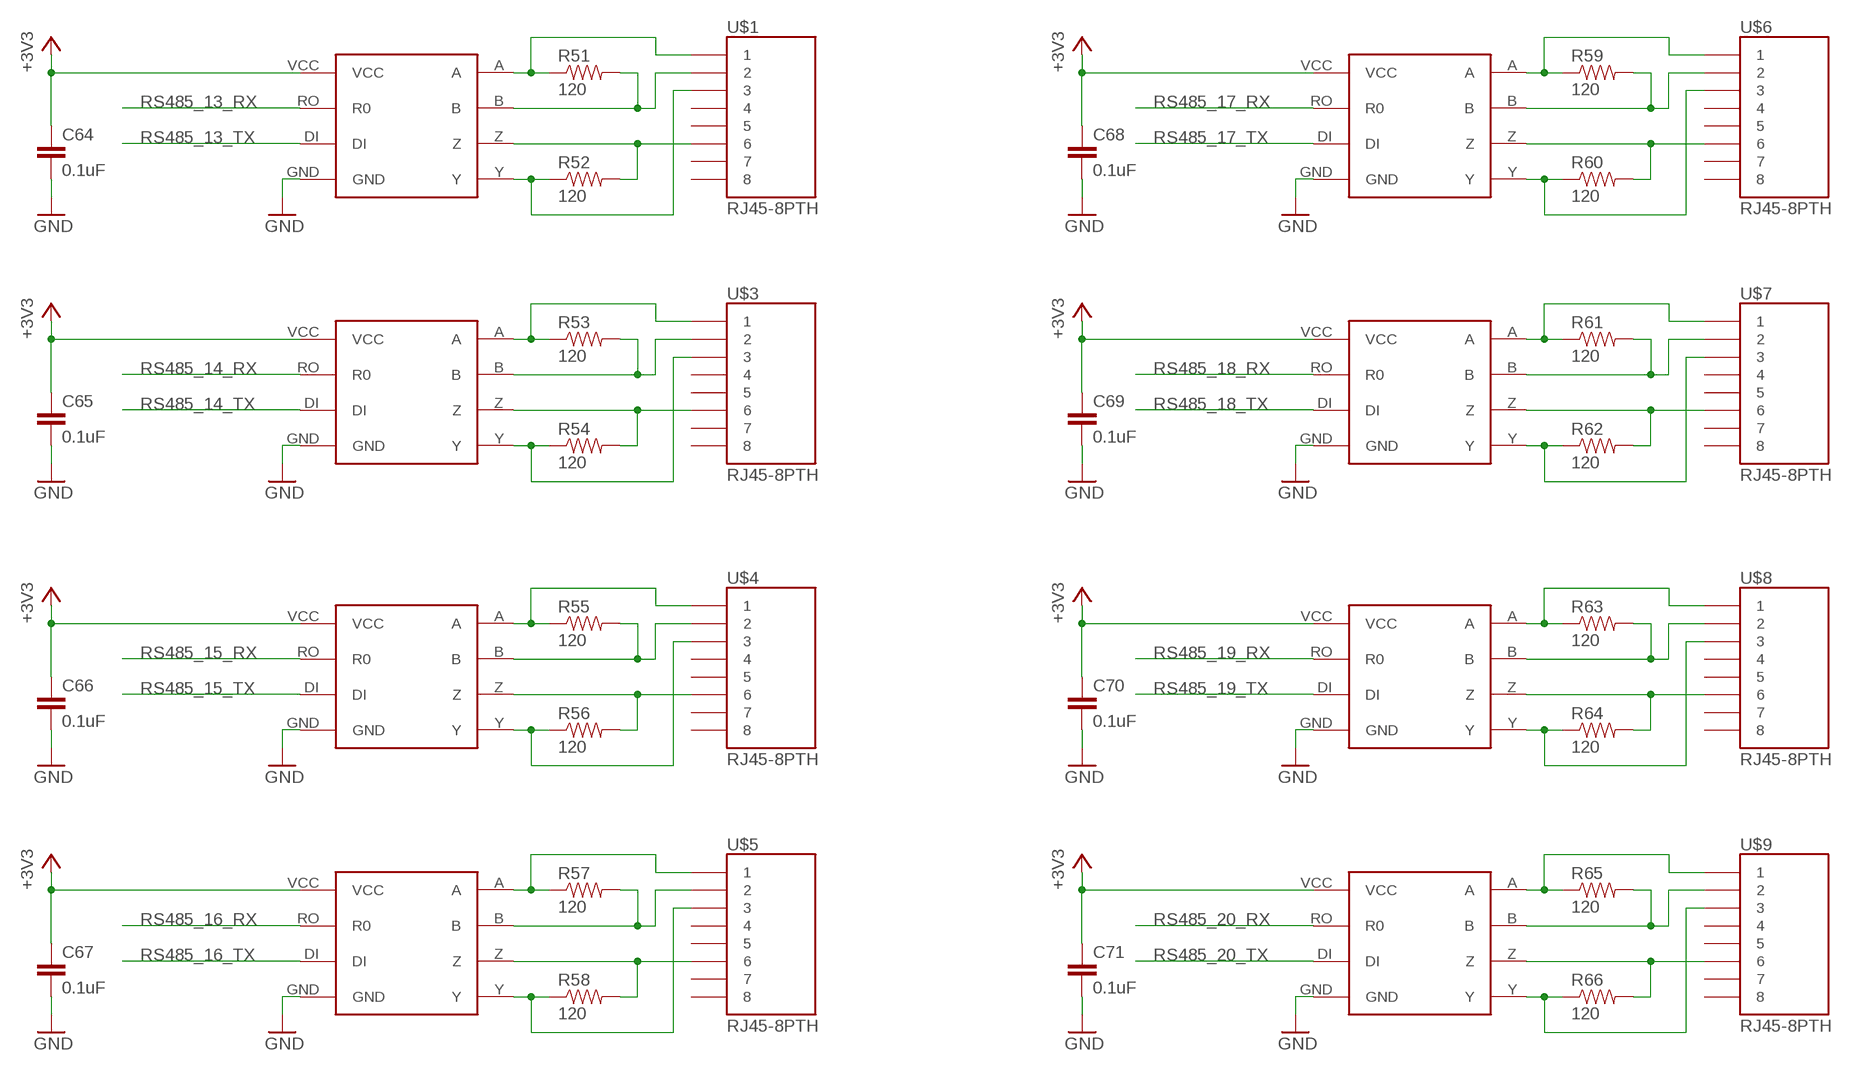
[diagram p4: schematic, sheet 5]

### Parts
C64  0.1uF  CAP1206  [1206]
C65  0.1uF  CAP1206  [1206]
C66  0.1uF  CAP1206  [1206]
C67  0.1uF  CAP1206  [1206]
C68  0.1uF  CAP1206  [1206]
C69  0.1uF  CAP1206  [1206]
C70  0.1uF  CAP1206  [1206]
C71  0.1uF  CAP1206  [1206]
R51  120  RESISTOR1206  [1206]
R52  120  RESISTOR1206  [1206]
R53  120  RESISTOR1206  [1206]
R54  120  RESISTOR1206  [1206]
R55  120  RESISTOR1206  [1206]
R56  120  RESISTOR1206  [1206]
R57  120  RESISTOR1206  [1206]
R58  120  RESISTOR1206  [1206]
R59  120  RESISTOR1206  [1206]
R60  120  RESISTOR1206  [1206]
R61  120  RESISTOR1206  [1206]
R62  120  RESISTOR1206  [1206]
R63  120  RESISTOR1206  [1206]
R64  120  RESISTOR1206  [1206]
R65  120  RESISTOR1206  [1206]
R66  120  RESISTOR1206  [1206]
RS-485-1  MAX3077  [MAX3070E]
RS-485-2  MAX3077  [MAX3070E]
RS-485-3  MAX3077  [MAX3070E]
RS-485-4  MAX3077  [MAX3070E]
RS-485-5  MAX3077  [MAX3070E]
RS-485-6  MAX3077  [MAX3070E]
RS-485-7  MAX3077  [MAX3070E]
RS-485-8  MAX3077  [MAX3070E]
U$1  RJ45-8PTH  [RJ45-8]
U$3  RJ45-8PTH  [RJ45-8]
U$4  RJ45-8PTH  [RJ45-8]
U$5  RJ45-8PTH  [RJ45-8]
U$6  RJ45-8PTH  [RJ45-8]
U$7  RJ45-8PTH  [RJ45-8]
U$8  RJ45-8PTH  [RJ45-8]
U$9  RJ45-8PTH  [RJ45-8]

### Nets
+3V3: C64.1 C65.1 C66.1 C67.1 C68.1 C69.1 C70.1 C71.1 RS-485-1.VCC RS-485-2.VCC RS-485-3.VCC RS-485-4.VCC RS-485-5.VCC RS-485-6.VCC RS-485-7.VCC RS-485-8.VCC ; also sheet 1,2,3,4,6,7,8,9
GND: C64.2 C65.2 C66.2 C67.2 C68.2 C69.2 C70.2 C71.2 RS-485-1.GND RS-485-2.GND RS-485-3.GND RS-485-4.GND RS-485-5.GND RS-485-6.GND RS-485-7.GND RS-485-8.GND ; also sheet 1,2,3,4,6,7,8,9
N$1: R51.1 RS-485-1.A U$1.1
N$2: R51.2 RS-485-1.B U$1.2
N$4: R52.1 RS-485-1.Y U$1.3
N$8: R54.2 RS-485-2.Z U$3.6
N$9: R52.2 RS-485-1.Z U$1.6
N$10: R53.1 RS-485-2.A U$3.1
N$11: R53.2 RS-485-2.B U$3.2
N$12: R54.1 RS-485-2.Y U$3.3
N$13: R56.2 RS-485-3.Z U$4.6
N$14: R55.1 RS-485-3.A U$4.1
N$15: R55.2 RS-485-3.B U$4.2
N$16: R56.1 RS-485-3.Y U$4.3
N$17: R58.2 RS-485-4.Z U$5.6
N$18: R57.1 RS-485-4.A U$5.1
N$19: R57.2 RS-485-4.B U$5.2
N$20: R58.1 RS-485-4.Y U$5.3
N$21: R60.2 RS-485-5.Z U$6.6
N$22: R59.1 RS-485-5.A U$6.1
N$28: R59.2 RS-485-5.B U$6.2
N$29: R60.1 RS-485-5.Y U$6.3
N$33: R62.2 RS-485-6.Z U$7.6
N$34: R61.1 RS-485-6.A U$7.1
N$35: R61.2 RS-485-6.B U$7.2
N$36: R62.1 RS-485-6.Y U$7.3
N$37: R64.2 RS-485-7.Z U$8.6
N$38: R63.1 RS-485-7.A U$8.1
N$39: R63.2 RS-485-7.B U$8.2
N$40: R64.1 RS-485-7.Y U$8.3
N$41: R66.2 RS-485-8.Z U$9.6
N$42: R65.1 RS-485-8.A U$9.1
N$43: R65.2 RS-485-8.B U$9.2
N$44: R66.1 RS-485-8.Y U$9.3
RS485_13_RX: RS-485-1.RO(R0) ; also sheet 3
RS485_13_TX: RS-485-1.DI ; also sheet 3
RS485_14_RX: RS-485-2.RO(R0) ; also sheet 3
RS485_14_TX: RS-485-2.DI ; also sheet 3
RS485_15_RX: RS-485-3.RO(R0) ; also sheet 3
RS485_15_TX: RS-485-3.DI ; also sheet 3
RS485_16_RX: RS-485-4.RO(R0) ; also sheet 3
RS485_16_TX: RS-485-4.DI ; also sheet 3
RS485_17_RX: RS-485-5.RO(R0) ; also sheet 3
RS485_17_TX: RS-485-5.DI ; also sheet 3
RS485_18_RX: RS-485-6.RO(R0) ; also sheet 3
RS485_18_TX: RS-485-6.DI ; also sheet 3
RS485_19_RX: RS-485-7.RO(R0) ; also sheet 3
RS485_19_TX: RS-485-7.DI ; also sheet 3
RS485_20_RX: RS-485-8.RO(R0) ; also sheet 3
RS485_20_TX: RS-485-8.DI ; also sheet 3
Unconnected: U$1.4 U$1.5 U$1.7 U$1.8 U$3.4 U$3.5 U$3.7 U$3.8 U$4.4 U$4.5 U$4.7 U$4.8 U$5.4 U$5.5 U$5.7 U$5.8 U$6.4 U$6.5 U$6.7 U$6.8 U$7.4 U$7.5 U$7.7 U$7.8 U$8.4 U$8.5 U$8.7 U$8.8 U$9.4 U$9.5 U$9.7 U$9.8

## Sheet 6 of 9: Sensors
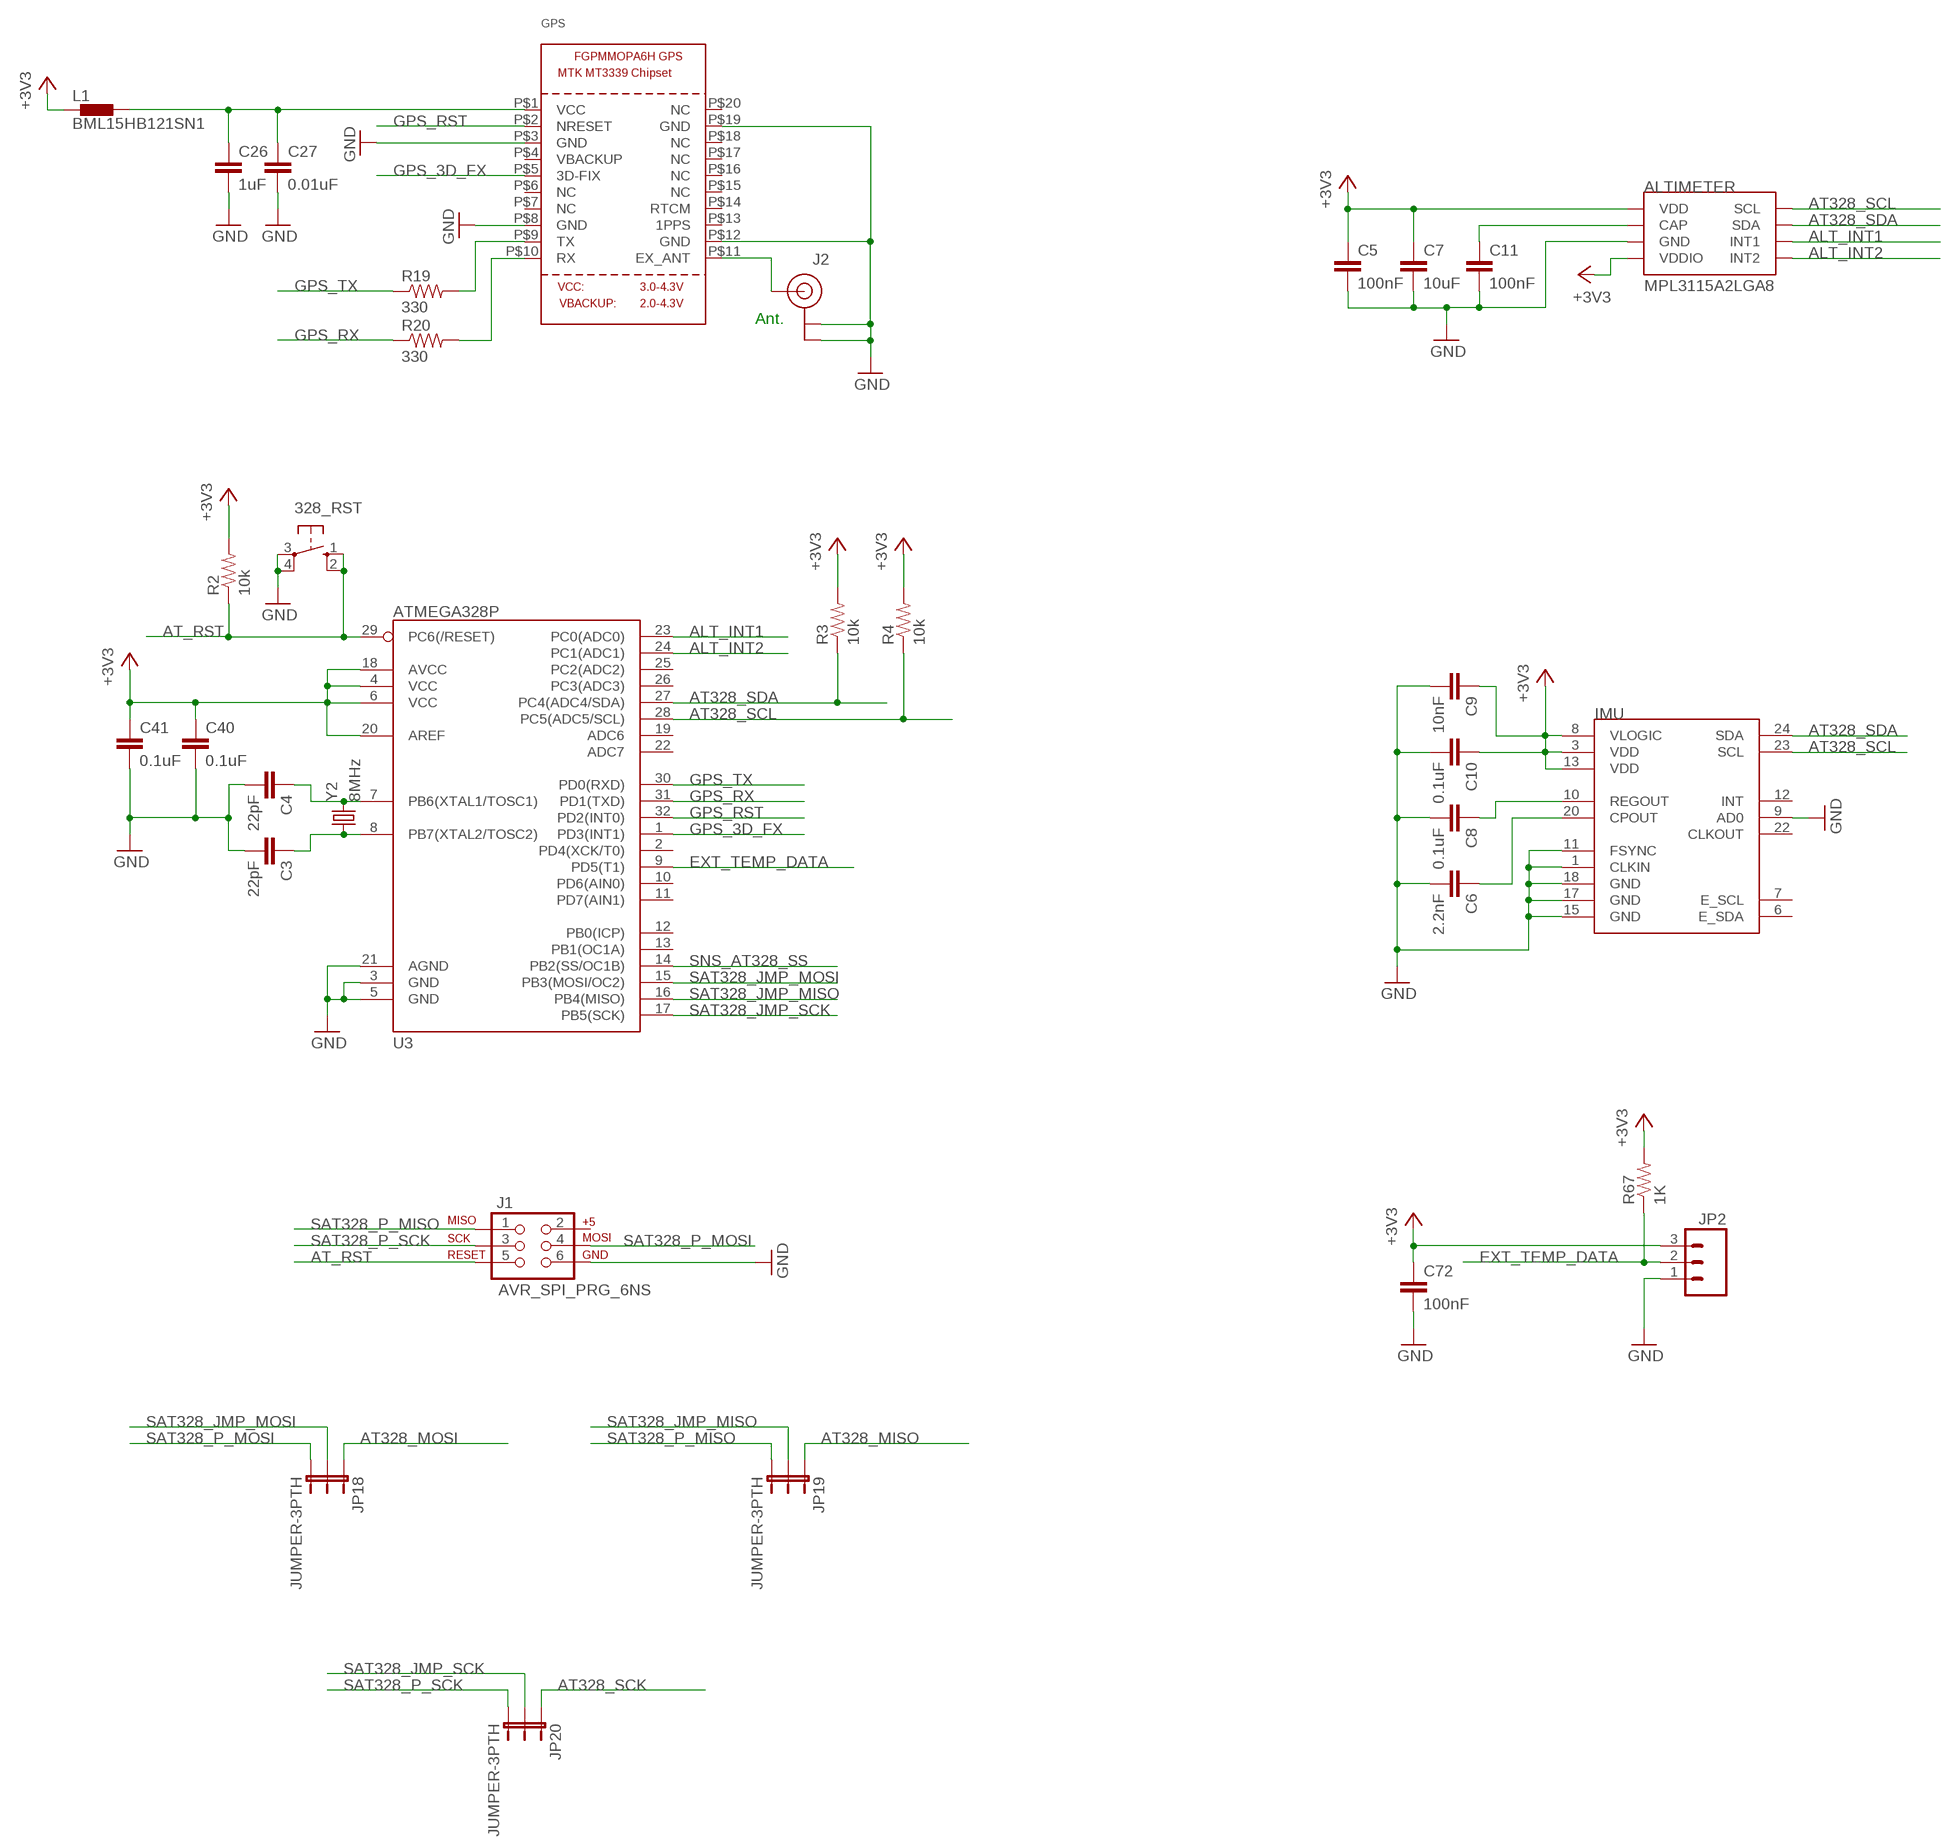
[diagram p5: schematic, sheet 6]

### Parts
328_RST  10-XX  [B3F-10XX]
ALTIMETER  MPL3115A2LGA8  [LGA8]
C3  22pF  CAP1206  [1206]
C4  22pF  CAP1206  [1206]
C5  100nF  CAP1206  [1206]
C6  2.2nF  CAP1206  [1206]
C7  10uF  CAP1206  [1206]
C8  0.1uF  CAP1206  [1206]
C9  10nF  CAP1206  [1206]
C10  0.1uF  CAP1206  [1206]
C11  100nF  CAP1206  [1206]
C26  1uF  CAP1206  [1206]
C27  0.01uF  CAP1206  [1206]
C40  0.1uF  CAP1206  [1206]
C41  0.1uF  CAP1206  [1206]
C72  100nF  CAP1206  [1206]
GPS  GPS_FGPMMOPA6H  [FGPMMOPA6H]
IMU  MPU-9150QFN-24-NP  [QFN-24-NP]
J1  AVR_SPI_PRG_6NS  [2X3-NS]
J2  U.FL  [U.FL]
JP2  M03PTH  [1X03]
JP18  JUMPER-3PTH  [1X03]
JP19  JUMPER-3PTH  [1X03]
JP20  JUMPER-3PTH  [1X03]
L1  BML15HB121SN1  [0402]
R2  10k  RESISTOR1206  [1206]
R3  10k  RESISTOR1206  [1206]
R4  10k  RESISTOR1206  [1206]
R19  330  RESISTOR1206  [1206]
R20  330  RESISTOR1206  [1206]
R67  1K  RESISTOR1206  [1206]
U3  ATMEGA328P  ATMEGA328_SMT  [TQFP32-08]
Y2  8MHz  CRYSTALHC49US  [HC49US]

### Nets
+3V3: ALTIMETER.1(VDD) ALTIMETER.4(VDDIO) C5.1 C7.1 C9.1 C10.1 C40.1 C41.1 C72.1 IMU.3(VDD) IMU.8(VLOGIC) IMU.13(VDD) JP2.3 L1.1 R2.2 R3.2 R4.2 R67.2 U3.4(VCC) U3.6(VCC) U3.18(AVCC) U3.20(AREF) ; also sheet 1,2,3,4,5,7,8,9
ALT_INT1: ALTIMETER.6(INT1) U3.23(PC0(ADC0))
ALT_INT2: ALTIMETER.5(INT2) U3.24(PC1(ADC1))
AT328_MISO: JP19.1 ; also sheet 1,8
AT328_MOSI: JP18.1 ; also sheet 1,8
AT328_SCK: JP20.1 ; also sheet 1,8
AT328_SCL: ALTIMETER.8(SCL) IMU.23(SCL) R4.1 U3.28(PC5(ADC5/SCL))
AT328_SDA: ALTIMETER.7(SDA) IMU.24(SDA) R3.1 U3.27(PC4(ADC4/SDA))
AT_RST: 328_RST.1(S) 328_RST.2(S1) J1.5 R2.1 U3.29(PC6(/RESET)) ; also sheet 1
ATCLK1: C4.1 U3.7(PB6(XTAL1/TOSC1)) Y2.2
ATCLK2: C3.1 U3.8(PB7(XTAL2/TOSC2)) Y2.1
EXT_TEMP_DATA: JP2.2 R67.1 U3.9(PD5(T1))
GND: 328_RST.3(P) 328_RST.4(P1) ALTIMETER.3(GND) C3.2 C4.2 C5.2 C6.2 C7.2 C8.2 C9.2 C10.2 C11.2 C26.2 C27.2 C40.2 C41.2 C72.2 GPS.P$3(GND) GPS.P$8(GND) GPS.P$12(GND) GPS.P$19(GND) IMU.1(CLKIN) IMU.9(AD0) IMU.11(FSYNC) IMU.15(GND) IMU.17(GND) IMU.18(GND) J1.6 J2.P$1(GND) J2.P$2(GND) JP2.1 U3.3(GND) U3.5(GND) U3.21(AGND) ; also sheet 1,2,3,4,5,7,8,9
GPS_3D_FX: GPS.P$5(3D-FIX) U3.1(PD3(INT1))
GPS_RST: GPS.P$2(NRESET) U3.32(PD2(INT0))
GPS_RX: R20.1 U3.31(PD1(TXD))
GPS_TX: R19.1 U3.30(PD0(RXD))
N$3: GPS.P$11(EX_ANT) J2.P$3(SIGNAL)
N$5: C6.1 IMU.20(CPOUT)
N$6: C8.1 IMU.10(REGOUT)
N$7: ALTIMETER.2(CAP) C11.1
N$47: C26.1 C27.1 GPS.P$1(VCC) L1.2
N$48: GPS.P$9(TX) R19.2
N$49: GPS.P$10(RX) R20.2
SAT328_JMP_MISO: JP19.2 U3.16(PB4(MISO))
SAT328_JMP_MOSI: JP18.2 U3.15(PB3(MOSI/OC2))
SAT328_JMP_SCK: JP20.2 U3.17(PB5(SCK))
SAT328_P_MISO: J1.1 JP19.3
SAT328_P_MOSI: J1.4 JP18.3
SAT328_P_SCK: J1.3 JP20.3
SNS_AT328_SS: U3.14(PB2(SS/OC1B)) ; also sheet 1
Unconnected: GPS.P$4(VBACKUP) GPS.P$6(NC) GPS.P$7(NC) GPS.P$13(1PPS) GPS.P$14(RTCM) GPS.P$15(NC) GPS.P$16(NC) GPS.P$17(NC) GPS.P$18(NC) GPS.P$20(NC) IMU.6(E_SDA) IMU.7(E_SCL) IMU.12(INT) IMU.22(CLKOUT) J1.2 U3.2(PD4(XCK/T0)) U3.10(PD6(AIN0)) U3.11(PD7(AIN1)) U3.12(PB0(ICP)) U3.13(PB1(OC1A)) U3.19(ADC6) U3.22(ADC7) U3.25(PC2(ADC2)) U3.26(PC3(ADC3))

### Notes on the sheet
- Ant.

## Sheet 7 of 9: Steering
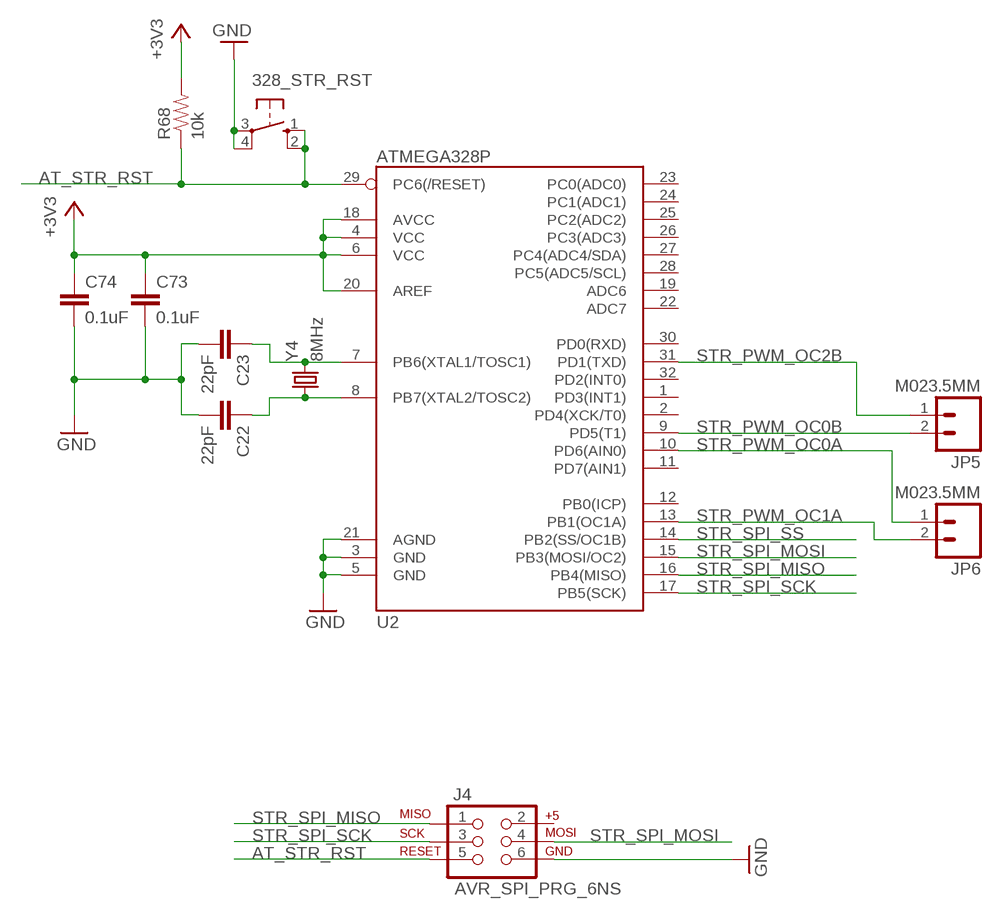
[diagram p6: schematic, sheet 7]

### Parts
328_STR_RST  10-XX  [B3F-10XX]
C22  22pF  CAP1206  [1206]
C23  22pF  CAP1206  [1206]
C73  0.1uF  CAP1206  [1206]
C74  0.1uF  CAP1206  [1206]
J4  AVR_SPI_PRG_6NS  [2X3-NS]
JP5  M023.5MM  [SCREWTERMINAL-3.5MM-2]
JP6  M023.5MM  [SCREWTERMINAL-3.5MM-2]
R68  10k  RESISTOR1206  [1206]
U2  ATMEGA328P  ATMEGA328_SMT  [TQFP32-08]
Y4  8MHz  CRYSTALHC49US  [HC49US]

### Nets
+3V3: C73.1 C74.1 R68.2 U2.4(VCC) U2.6(VCC) U2.18(AVCC) U2.20(AREF) ; also sheet 1,2,3,4,5,6,8,9
AT_STR_RST: 328_STR_RST.1(S) 328_STR_RST.2(S1) J4.5 R68.1 U2.29(PC6(/RESET)) ; also sheet 1
ATCLK3: C22.1 U2.8(PB7(XTAL2/TOSC2)) Y4.1
ATCLK4: C23.1 U2.7(PB6(XTAL1/TOSC1)) Y4.2
GND: 328_STR_RST.3(P) 328_STR_RST.4(P1) C22.2 C23.2 C73.2 C74.2 J4.6 U2.3(GND) U2.5(GND) U2.21(AGND) ; also sheet 1,2,3,4,5,6,8,9
STR_PWM_OC0A: JP6.1 U2.10(PD6(AIN0))
STR_PWM_OC0B: JP5.2 U2.9(PD5(T1))
STR_PWM_OC1A: JP6.2 U2.13(PB1(OC1A))
STR_PWM_OC2B: JP5.1 U2.31(PD1(TXD))
STR_SPI_MISO: J4.1 U2.16(PB4(MISO)) ; also sheet 1
STR_SPI_MOSI: J4.4 U2.15(PB3(MOSI/OC2)) ; also sheet 1
STR_SPI_SCK: J4.3 U2.17(PB5(SCK)) ; also sheet 1
STR_SPI_SS: U2.14(PB2(SS/OC1B)) ; also sheet 1
Unconnected: J4.2 U2.1(PD3(INT1)) U2.2(PD4(XCK/T0)) U2.11(PD7(AIN1)) U2.12(PB0(ICP)) U2.19(ADC6) U2.22(ADC7) U2.23(PC0(ADC0)) U2.24(PC1(ADC1)) U2.25(PC2(ADC2)) U2.26(PC3(ADC3)) U2.27(PC4(ADC4/SDA)) U2.28(PC5(ADC5/SCL)) U2.30(PD0(RXD)) U2.32(PD2(INT0))

## Sheet 8 of 9: Fan Control
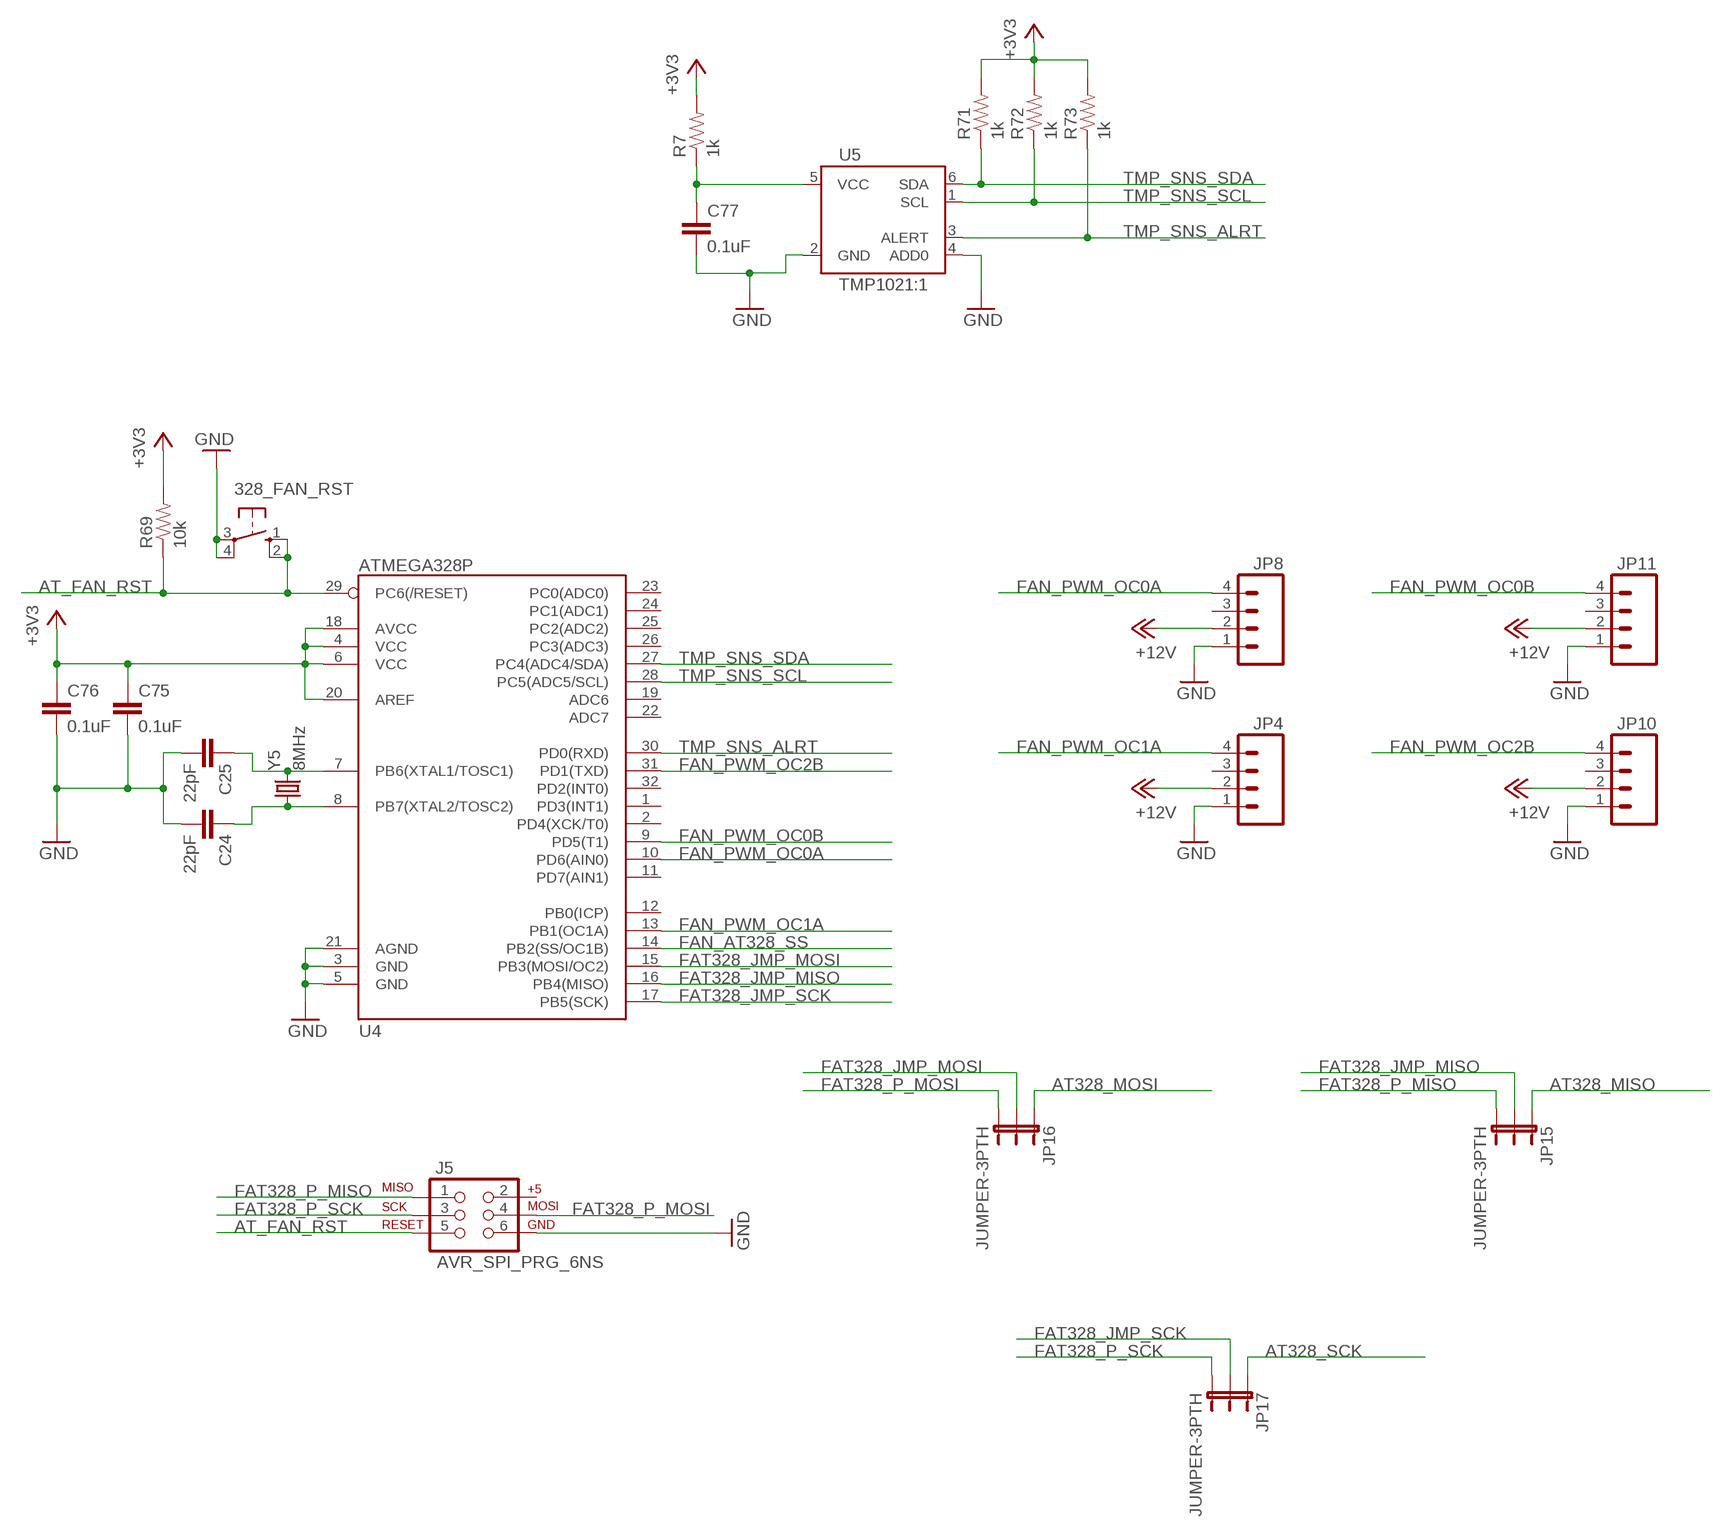
[diagram p7: schematic, sheet 8]

### Parts
328_FAN_RST  10-XX  [B3F-10XX]
C24  22pF  CAP1206  [1206]
C25  22pF  CAP1206  [1206]
C75  0.1uF  CAP1206  [1206]
C76  0.1uF  CAP1206  [1206]
C77  0.1uF  CAP1206  [1206]
J5  AVR_SPI_PRG_6NS  [2X3-NS]
JP4  M04POLAR  [MOLEX-1X4]
JP8  M04POLAR  [MOLEX-1X4]
JP10  M04POLAR  [MOLEX-1X4]
JP11  M04POLAR  [MOLEX-1X4]
JP15  JUMPER-3PTH  [1X03]
JP16  JUMPER-3PTH  [1X03]
JP17  JUMPER-3PTH  [1X03]
R7  1k  RESISTOR1206  [1206]
R69  10k  RESISTOR1206  [1206]
R71  1k  RESISTOR1206  [1206]
R72  1k  RESISTOR1206  [1206]
R73  1k  RESISTOR1206  [1206]
U4  ATMEGA328P  ATMEGA328_SMT  [TQFP32-08]
U5  TMP1021:1  [SOT563-2]
Y5  8MHz  CRYSTALHC49US  [HC49US]

### Nets
+3V3: C75.1 C76.1 R7.2 R69.2 R71.2 R72.2 R73.2 U4.20(AREF) ; also sheet 1,2,3,4,5,6,7,9
+12V: JP4.2 JP8.2 JP10.2 JP11.2 ; also sheet 9
AT328_MISO: JP15.1 ; also sheet 1,6
AT328_MOSI: JP16.1 ; also sheet 1,6
AT328_SCK: JP17.1 ; also sheet 1,6
AT_FAN_RST: 328_FAN_RST.1(S) 328_FAN_RST.2(S1) J5.5 R69.1 U4.29(PC6(/RESET)) ; also sheet 1
ATCLK5: C24.1 U4.8(PB7(XTAL2/TOSC2)) Y5.1
ATCLK6: C25.1 U4.7(PB6(XTAL1/TOSC1)) Y5.2
FAN_AT328_SS: U4.14(PB2(SS/OC1B)) ; also sheet 1
FAN_PWM_OC0A: JP8.4 U4.10(PD6(AIN0))
FAN_PWM_OC0B: JP11.4 U4.9(PD5(T1))
FAN_PWM_OC1A: JP4.4 U4.13(PB1(OC1A))
FAN_PWM_OC2B: JP10.4 U4.31(PD1(TXD))
FAT328_JMP_MISO: JP15.2 U4.16(PB4(MISO))
FAT328_JMP_MOSI: JP16.2 U4.15(PB3(MOSI/OC2))
FAT328_JMP_SCK: JP17.2 U4.17(PB5(SCK))
FAT328_P_MISO: J5.1 JP15.3
FAT328_P_MOSI: J5.4 JP16.3
FAT328_P_SCK: J5.3 JP17.3
GND: 328_FAN_RST.3(P) 328_FAN_RST.4(P1) C24.2 C25.2 C75.2 C76.2 C77.2 J5.6 JP4.1 JP8.1 JP10.1 JP11.1 U4.3(GND) U4.5(GND) U4.21(AGND) U5.2(GND) U5.4(ADD0) ; also sheet 1,2,3,4,5,6,7,9
N$61: C77.1 R7.1 U5.5(VCC)
TMP_SNS_ALRT: R73.1 U4.30(PD0(RXD)) U5.3(ALERT)
TMP_SNS_SCL: R72.1 U4.28(PC5(ADC5/SCL)) U5.1(SCL)
TMP_SNS_SDA: R71.1 U4.27(PC4(ADC4/SDA)) U5.6(SDA)
Unconnected: J5.2 JP4.3 JP8.3 JP10.3 JP11.3 U4.1(PD3(INT1)) U4.2(PD4(XCK/T0)) U4.4(VCC) U4.6(VCC) U4.11(PD7(AIN1)) U4.12(PB0(ICP)) U4.18(AVCC) U4.19(ADC6) U4.22(ADC7) U4.23(PC0(ADC0)) U4.24(PC1(ADC1)) U4.25(PC2(ADC2)) U4.26(PC3(ADC3)) U4.32(PD2(INT0))

## Sheet 9 of 9: Power
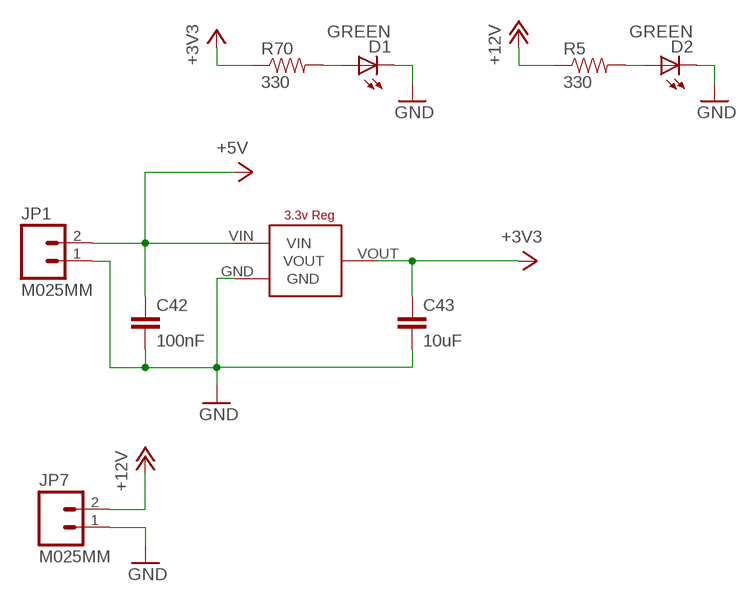
[diagram p8: schematic, sheet 9]

### Parts
C42  100nF  CAP1206  [1206]
C43  10uF  CAP1206  [1206]
D1  GREEN  LED-GREENLARGE  [LED-1206]
D2  GREEN  LED-GREENLARGE  [LED-1206]
JP1  M025MM  [SCREWTERMINAL-5MM-2]
JP7  M025MM  [SCREWTERMINAL-5MM-2]
R5  330  RESISTOR1206  [1206]
R70  330  RESISTOR1206  [1206]
U$2  LD1117  [LD1117SOT-223]

### Nets
+3V3: C43.1 R70.1 U$2.VOUT ; also sheet 1,2,3,4,5,6,7,8
+5V: C42.1 JP1.2 U$2.VIN
+12V: JP7.2 R5.1 ; also sheet 8
GND: C42.2 C43.2 D1.C D2.C JP1.1 JP7.1 U$2.GND ; also sheet 1,2,3,4,5,6,7,8
N$45: D1.A R70.2
N$59: D2.A R5.2

## Power pins joined to a net without a drawn wire
VBAT: U1.30(A:VBAT)

## Library data of the parts
328_FAN_RST 328_RST 328_STR_RST ARM_RST = switch-omron:10-XX: OMRON SWITCH; MPN: B3F-1000; OC_FARNELL: 176432; OC_NEWARK: 36M3542
ALTIMETER = SparkFun-Sensors:MPL3115A2: Altimeter/Pressure Sensor, I2C, 1.95V-3.6V supply, 50 to 110kPa
BLUETOOTH = SPBT2632C2A:SPBT2632C2A
C1-C28 C31-C77 = SparkFun-Passives:CAP: Capacitor Standard 0603 ceramic capacitor, and 0.1" leaded capacitor.
C29 C30 = SparkFun-Passives:CAP_POL: Capacitor Polarized These are standard SMD and PTH capacitors. Normally 10uF, 47uF, and 100uF in electrolytic and tantalum varieties. Always verify the external diameter of the through hole cap, it varies with capacity, voltage, and manufacturer. The EIA devices should be standard.
D1 D2 = SparkFun-LED:LED-GREEN: Various green LEDs 0603- DIO-00821 LARGE- DIO-00862 LILYPAD- DIO-09910; PROD_ID: DIO-00862
GPS = adafruit:GPS_FGPMMOPA6H: GPS Module - MTK MT3339 Chipset, -165dBm sensitivity, 22 channels, 10Hz, auto-select external antenna options
IMU = SparkFun-Sensors:MPU-9150: 9DOF (3mag, 3accel, 3rotat). I2C interface.
J1 J4 J5 = SparkFun-Connectors:AVR_SPI_PRG_6: AVR ISP 6 Pin This is the reduced ISP connector for AVR programming. Common on Arduino. This footprint will take up less PCB space and can be used with a 10-pin to 6-pin adapter such as SKU: BOB-08508
J2 = SparkFun-Connectors:U.FL: SMD antenna connector- WRL-09144
J3 = SparkFun-Connectors:MAGJACK: RJ-45 with LEDs
JP1 JP5-JP7 = SparkFun-Connectors:M02: Standard 2-pin 0.1" header. Use with - straight break away headers ( PRT-00116) - right angle break away headers (PRT-00553) - swiss pins (PRT-00743) - machine pins (PRT-00117) - female headers (PRT-00115) Molex polarized connector foot print use with: PRT-08233 with associated crimp pins and housings. 2.54_SCREWTERM for use with PRT-10571. 3.5mm Screw Terminal footprints for PRT-08084 5mm Screw Terminal footprints for use with PRT-08433
JP2 = SparkFun-Connectors:M03: Header 3 Standard 3-pin 0.1" header. Use with straight break away headers (SKU : PRT-00116), right angle break away headers (PRT-00553), swiss pins (PRT-00743), machine pins (PRT-00117), and female headers (PRT-00115). Molex polarized connector foot print use with SKU : PRT-08232 with associated crimp pins and housings.
JP3 JP4 JP8-JP13 = SparkFun-Connectors:M04: Header 4 Standard 4-pin 0.1" header. Use with straight break away headers (SKU : PRT-00116), right angle break away headers (PRT-00553), swiss pins (PRT-00743), machine pins (PRT-00117), and female headers (PRT-00115). Molex polarized connector foot print use with SKU : PRT-08231 with associated crimp pins and housings. 1MM SMD Version SKU: PRT-10208
JP15-JP20 = SparkFun-Passives:JUMPER-3
JTAG_CON = SparkFun-Connectors:M10X2: This was SPECIALLY designed to be used with our Graphic LCD Backpack. Be sure you want to use this! It is not only staggered on each line of header holes, but IT IS ALSO offset of the center point of the top and bottom lines by 5 mil. This causes the headers to lock into place on the "standard" footprint on the LCD screen. The extra squares on the tdocu layer are there simply to reference other pins (if you were to actually populate a longer header than ten long - this is what we do with the backpacks).
L1 = inductors:BML15H: EMIFIL (R) Chip Ferrite Bead for GHz Noise Source: http://www.murata.com/ Ferrite Bead BLM15H.pdf
R1-R4 R68 R69 = SparkFun-Resistors:RESISTOR: Resistor Basic schematic elements and footprints for 0603, 1206, and PTH resistors.
R5-R67 R70-R73 = SparkFun-Passives:RESISTOR: Resistor Basic schematic elements and footprints for 0603, 1206, and PTH resistors.
RS-485-1-RS-485-8 RS_TRANS_1-RS_TRANS_12 = MAX3077:MAX3077
RX_MUX_1-RX_MUX_4 TX_MUX_1-TX_MUX_4 = MC74LVXT8051:MC74LVXT8051DG
U1 = Main_Processor:MK10DN512ZVLL10: MCU, 32 BIT, KINETIS, K10, LQFP-100; MPN: MK10DN512ZVLL10; OC_FARNELL: 2070276; OC_NEWARK: 75T7577; PACKAGE: LQFP-100; SUPPLIER: FREESCALE SEMICONDUCTOR
U2-U4 = SparkFun-DigitalIC:ATMEGA328_SMT: 32-Pin Atmega328 part Commonly used on Arduino compatible boards Available in QFP and QFN packages TQFP is IC-09069 QFN is non-stock; PROD_ID: IC-09069
U5 = SparkFun-Sensors:TMP102: I2C degC temp sensor
U$1 U$3-U$9 = SparkFun-Connectors:RJ45-8: RJ45 Jack Simple RJ45, 8-pin connection - connector for common Cat5, Cat5e, and Cat6 Ethernet cables. Footprint not yet proven in production. Connector sku is PRT-00643; Breakout PCB sku is BOB-00716.
U$2 = LD1117:LD1117
U$10 = SparkFun-Electromechanical:POT
U$11 = w5500_wiznet:W5500
U$36 = harting-scsi:TB60050685100
Y2-Y6 = SparkFun-FreqCtrl:CRYSTAL: Various standard crystals. Proven footprints. Spark Fun Electronics SKU : COM-00534